# Altium project Daughter_Board_IFRX_L.PrjPcb (part 1 of 2)
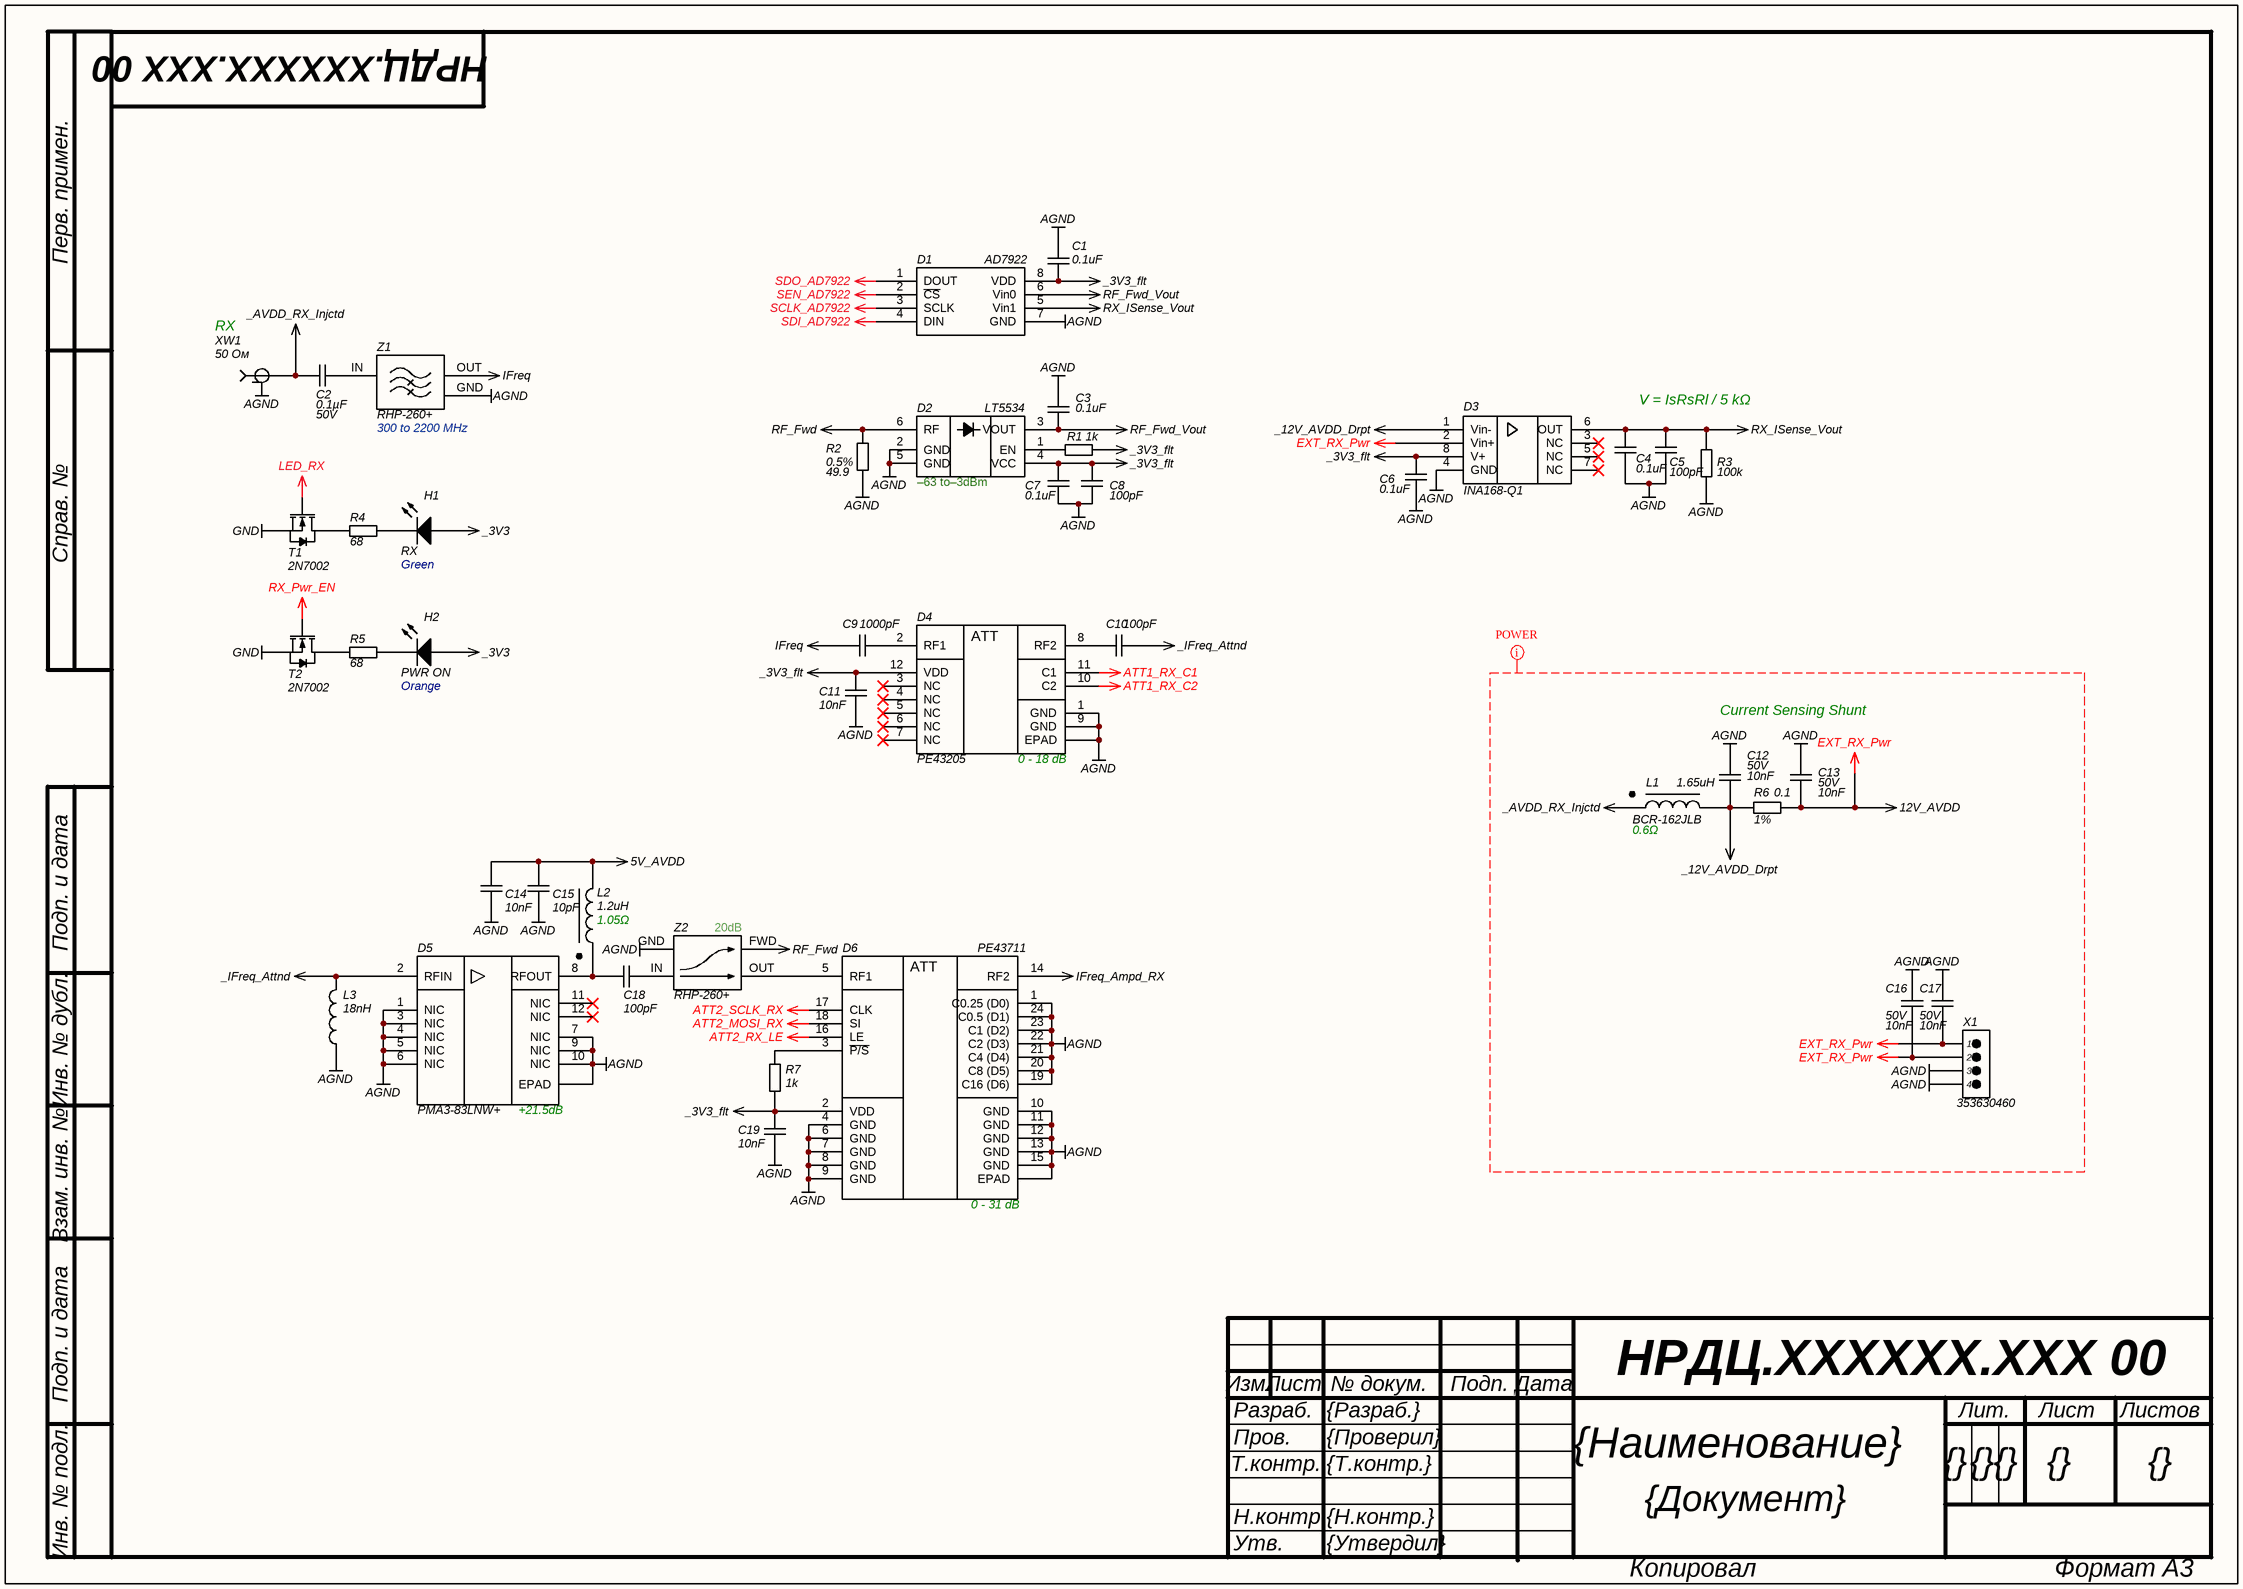
[diagram p0: RX.SchDoc]
7 sheets, 373 parts. Net scope: global (net labels, ports and power ports of the same name join across sheets).
Sheets:
  RX.SchDoc
  IF_RX.SchDoc
  ADC.SchDoc
  ADC_CLK.SchDoc
  CPLD.SchDoc
  Power.SchDoc
  DBoard_Conn.SchDoc

## Sheet RX.SchDoc: {Наименование}
size 420 x 297 mm; ApprovedBy: {Утвердил}; CheckedBy: {Проверил}; DrawnBy: {Разраб.}; DocumentNumber: НРДЦ.ХХХХХХ.ХХХ 00; SheetNumber: {}; SheetTotal: {}; Scale: {Мш.}; PageSetup: Record=PageOptions|CenterHorizontal=False|CenterVertical=False|PrintScale=0.95|XCorrection=0.00|YCorrection=0.00|PrintKind=1|BorderSize=5000000|LeftOffset=0|BottomOffset=0|Orientation=1|PaperLength=1000|PaperWidth=1000|Scale=100|PaperSource=15|PrintQuality=600|MediaType=1|DitherType=10|PaperKind=A4|PrintScaleMode=1; ProcessInspection: {Т.контр.}; Mass: {М.}; NormInspection: {Н.контр.}; Letter1Column: {}; Letter2Column: {}; Letter3Column: {}; DocumentType: {Документ}; Rule: PcbType=ProtelPcb

### Parts
C1  value 0.1uF  [C0402]  (hidden comment: CAP)
C2  value 0.1µF  Voltage: 50V  [C1206]  (hidden comment: CAP)
C3  value 0.1uF  [C0402]  (hidden comment: CAP)
C4  value 0.1uF  [C0402]  (hidden comment: CAP)
C5  value 100pF  [C0402]  (hidden comment: CAP)
C6  value 0.1uF  [C0402]  (hidden comment: CAP)
C7  value 0.1uF  [C0402]  (hidden comment: CAP)
C8  value 100pF  [C0402]  (hidden comment: CAP)
C9  value 1000pF  [C0402]  (hidden comment: CAP)
C10  value 100pF  [C0402]  (hidden comment: CAP)
C11  value 10nF  [C0402]  (hidden comment: CAP)
C12  value 10nF  Voltage: 50V  [C0402]  (hidden comment: CAP)
C13  value 10nF  Voltage: 50V  [C0402]  (hidden comment: CAP)
C14  value 10nF  [C0402]  (hidden comment: CAP)
C15  value 10pF  [C0402]  (hidden comment: CAP)
C16  value 10nF  Voltage: 50V  [C0402]  (hidden comment: CAP)
C17  value 10nF  Voltage: 50V  [C0402]  (hidden comment: CAP)
C18  value 100pF  [C0402]  (hidden comment: CAP)
C19  value 10nF  [C0402]  (hidden comment: CAP)
D1  AD7922  [MSOP-8]
D2  LT5534  RF Input Power Range: –63 to–3dBm  [SC70]
D3  INA168-Q1  [TSSOP (8)]
D4  PE43205  [QFN-12]
D5  PMA3-83LNW+  [DQ1225]
D6  PE43711  [QFN-24]
H1  RX  Color: Green  [LED]
H2  PWR ON  Color: Orange  [LED]
L1  BCR-162JLB  value 1.65uH  DCR: 0.6Ω  [BCR-162]
L2  value 1.2uH  DCR: 1.05Ω  [BCR-122]  (hidden comment: Inductor_BCR)
L3  value 18nH  [L0603_HP]  (hidden comment: Inductor RF)
R1  value 1k  [R0402]  (hidden comment: RES)
R2  value 49.9  Tolerance: 0.5%  [R0402]  (hidden comment: RES)
R3  value 100k  [R0402]  (hidden comment: RES)
R4  value 68  [R0402]  (hidden comment: RES)
R5  value 68  [R0402]  (hidden comment: RES)
R6  value 0.1  Tolerance: 1%  [R0805]  (hidden comment: RES)
R7  value 1k  [R0402]  (hidden comment: RES)
T1  2N7002  [SOT-23]
T2  2N7002  [SOT-23]
X1  353630460  [CON_353630460]
XW1  50 Ом  [MOLEX SD-73251-135 (Gold)]
Z1  RHP-260+  Frequency: 300 to 2200 MHz  [GP731]
Z2  RHP-260+  Coupling: 20dB  [AH202]

### Nets
5V_AVDD: C14.2 C15.2 L2.2
12V_AVDD: C13.1 C16.2 C17.2 D3.2(Vin+) R6.1 X1.1 X1.2  [also labelled EXT_RX_Pwr]
_3V3: H1.2(A) H2.2(A)
_3V3_flt: C1.1 C6.2 C7.2 C8.2 C11.2 C19.2 D1.8(VDD) D2.4(VCC) D3.8(V+) D4.12(VDD) D6.2(VDD) R1.1 R7.1
_12V_AVDD_Drpt: C12.1 D3.1(Vin-) L1.2 R6.2
_AVDD_RX_Injctd: C2.1 L1.1 XW1.S(RF)
_IFreq_Attnd: C10.2 D5.2(RFIN) L3.2
AGND: C1.2 C3.1 C4.1 C5.1 C6.1 C7.1 C8.1 C11.1 C12.2 C13.2 C14.1 C15.1 C16.1 C17.1 C19.1 D1.7(GND) D2.2(GND) D2.5(GND) D3.4(GND) D4.1(GND) D4.9(GND) D4.13(EPAD) D5.1(NIC) D5.3(NIC) D5.4(NIC) D5.5(NIC) D5.6(NIC) D5.7(NIC) D5.9(NIC) D5.10(NIC) D5.13(EPAD) D6.1(C0.25_(D0)) D6.4(GND) D6.6(GND) D6.7(GND) D6.8(GND) D6.9(GND) D6.10(GND) D6.11(GND) D6.12(GND) D6.13(GND) D6.15(GND) D6.19(C16_(D6)) D6.20(C8_(D5)) D6.21(C4_(D4)) D6.22(C2_(D3)) D6.23(C1_(D2)) D6.24(C0.5_(D1)) D6.25(EPAD) L3.1 R2.2 R3.1 X1.3 X1.4 XW1.G(GND) Z1.GND
ATT1_RX_C1: D4.11(C1)
ATT1_RX_C2: D4.10(C2)
ATT2_MOSI_RX: D6.18(SI)
ATT2_RX_LE: D6.16(LE)
ATT2_SCLK_RX: D6.17(CLK)
GND: T1.2(S) T2.2(S)
IFreq: C9.1 Z1.OUT
IFreq_Ampd_RX: D6.14(RF2)
LED_RX: T1.1(G)
RF_Fwd: D2.6(RF) R2.1 Z2.FWD
RF_Fwd_Vout: C3.2 D1.6(Vin0) D2.3(VOUT)
RX_ISense_Vout: C4.2 C5.2 D1.5(Vin1) D3.6(OUT) R3.2
RX_Pwr_EN: T2.1(G)
SCLK_AD7922: D1.3(SCLK)
SDI_AD7922: D1.4(DIN)
SDO_AD7922: D1.1(DOUT)
SEN_AD7922: D1.2(~{CS})
NetC2_2: C2.2 Z1.IN
NetC9_2: C9.2 D4.2(RF1)
NetC10_1: C10.1 D4.8(RF2)
NetC18_1: C18.1 D5.8(RFOUT) L2.1
NetC18_2: C18.2 Z2.IN
NetD2_1: D2.1(EN) R1.2
NetD6_3: D6.3(~{P/S}) R7.2
NetD6_5: D6.5(RF1) Z2.OUT
NetH1_1: H1.1(K) R4.2
NetH2_1: H2.1(K) R5.1
NetR4_1: R4.1 T1.3(D)
NetR5_2: R5.2 T2.3(D)

Not connected (* = marked no-connect by the designer): D3 3(NC)* 5(NC)* 7(NC)*; D4 3(NC)* 4(NC)* 5(NC)* 6(NC)* 7(NC)*; D5 11(NIC)* 12(NIC)*; Z2 GND

### Layout directives
net class POWER: 12V_AVDD, _12V_AVDD_Drpt, _AVDD_RX_Injctd, AGND, EXT_RX_Pwr

### Notes on the sheet
- (near XW1) RX
- V = IsRsRl / 5 kΩ
- Current Sensing Shunt
- Labels drawn without touching a wire or pin: AGND
- Перв. примен.
- Справ. №
- Подп. и дата
- Инв. № дубл.
- Взам. инв. №
- Изм.
- Лист
- № докум.
- Подп.
- Дата
- Т.контр.
- Пров.
- Разраб.
- Лит.
- Листов
- Инв. № подл.
- Н.контр.
- Утв.
- Копировал
- Формат А3
- (in symbol PE43205) ATT; 0 - 18 dB
- (in symbol PE43711) ATT; 0 - 31 dB
- (in symbol PMA3-83LNW+) +21.5dB

### Library data of the parts
C1 C3 C4 C6 C7 = CAP: SMD Capacitor; Manufacturer: Murata; Material: X7R; Tolerance: 10%; Voltage: 10V; Type: Ceramic Capacitor; P/N: GRM155R71A104KA01J
C2 = CAP: SMD Capacitor; Manufacturer: Murata; Material: NP0; Tolerance: 5%; Type: Ceramic Capacitor; P/N: GRM31C5C1H104JA01K
C5 C8 C10 C18 = CAP: SMD Capacitor; Manufacturer: Murata; Material: NP0; Tolerance: 1%; Voltage: 50V; Type: Ceramic Capacitor; P/N: GRM1555C1H101FA01D
C9 = CAP: SMD Capacitor; Manufacturer: Murata; Material: NP0; Tolerance: 5%; Voltage: 50V; Type: Ceramic Capacitor; P/N: GRM1555C1H102JA01D
C11 C14 C19 = CAP: SMD Capacitor; Manufacturer: Murata; Material: X7R; Tolerance: 10%; Voltage: 25V; Type: Ceramic Capacitor; P/N: GRM155R71E103KA01D
C12 C13 C16 C17 = CAP: SMD Capacitor; Manufacturer: Murata; Material: X7R; Tolerance: 5%; Type: Ceramic Capacitor; P/N: GRM155R71H103JA88D
C15 = CAP: SMD Capacitor; Manufacturer: Murata; Material: NP0; Tolerance: 1%; Voltage: 50V; Type: Ceramic Capacitor; P/N: GRM1555C1H100FA01D
D1 = AD79x2: 1 MSPS, 10-/12-Bit ADC; Manufacturer: Analog Device; Fast throughput rate: 1MHz; High speed serial interface: SPI®/QSPI™/MICROWIRE™/DSP compatible; Name: AD7922ARM; Type: 2-Channel, 2.35 V to 5.25 V,1 MSPS, 10-/12-Bit ADC; Voltage: 2.35 V to 5.25 V; Package: MSOP-8
D2 = LT5534: 50MHz to 3GHz monolithic RF power / detector; Manufacturer: Linear Technology; Voltage: Single 2.7V to 5.25V; Impedance: 2kΩ; Frequency Range: 50 to 3000 MHz; Name: LT5534; Package: 6-Lead SC70; Type: RF Power Detector; P/N: LT5534; Supplier 1: Digi-Key; Supplier Part Number 1: LT5534ESC6#TRMPBFCT-ND
D3 = INA168-Q1: Automotive-Grade, High-Side, Current-Output, Current-Shunt Monitor; Manufacturer: Texas Instruments; Name: INA168Q; Voltage: 2.7 V to 60 V; P/N: INA168QPWRQ1; Voltage Gain: Adjustable; Frequency Range: 800kHz; Package: TSSOP (8); Type: Current-Shunt Monitor; Supplier 1: Digi-Key; Supplier Part Number 1: 296-17201-1-ND
D4 = PE43205: 50Ω, HaRP™ technology-enhanced / fast switching 2-bit RF Digital Step Attenuator; Manufacturer: Peregrine Technical Solutions; Type: 2-bit, 18 dB; Name: PE43205; P/N: PE43205; Package: Green 12-lead 3x3 mm QFN; Supplier 1: Digi-Key; Supplier Part Number 1: 1046-1114-6-ND
D5 = PMA3-83LNW+: PHEMT based wideband, low noise MMIC amplifier; Manufacturer: Mini-Circuits; Type: LNA; Frequency Range: 0.4 to 8.0 GHz; Impedance: 50Ω; Name: PMA3-83LNW+; Package: DQ1225; P/N: PMA3-83LNW+; Supplier 1: Digi-Key; Supplier Part Number 1: 3157-PMA3-83LNW+CT-ND
D6 = PE43711: The PE43711 is a 50Ω, HaRP™ technology-enhanced, 7-bit RF digital step attenuator; Manufacturer: Peregrine Technical Solutions; P/N: PE43711A-Z; Type: 7-bit RF digital step attenuator (DSA); Name: PE43711; Package: 24-lead 4 × 4 × 0.85 mm QFN; Supplier 1: Digi-Key; Supplier Part Number 1: 1046-1138-1-ND
H1 = LED: CHIP LED LAMP; Manufacturer: Kingbright; Name: APHCM2012; P/N: APHCM2012CGCK-F01; Package: 2.0 x 1.25 mm SMD; Type: CHIP LED LAMP; Supplier 1: Digi-Key; Supplier Part Number 1: 754-1094-1-ND
H2 = LED: CHIP LED LAMP; Manufacturer: Kingbright; Name: APHCM2012; P/N: APHCM2012SECK-F01; Package: 2.0 x 1.25 mm SMD; Type: CHIP LED LAMP
L1 = Inductor_BCR: Broadband Conical Inductor; Manufacturer: Coilcraft; Current: 490mA; Frequency: 40GHz; Tolerance: ±5%; Name: BCR-162JL; Series: BCR-162; Temperature Range: -25…85°C; P/N: BCR-162JLB
L2 = Inductor_BCR: Broadband Conical Inductor; Manufacturer: Coilcraft; Current: 270mA; Frequency: 40GHz; Name: BCR-122JL; Tolerance: ±5%; P/N: BCR-12LB; Series: BCR-122; Temperature Range: -25…85°C
L3 = Inductor RF: Chip SMD Inductor; Manufacturer: Coilcraft; Current: 1200mA; Frequency: 3.30GHz; Name: 0603HP-18NXJE; Tolerance: 5%; Series: 0603HP; Temperature Range: -25…85°C; P/N: 0603HP-18NXJE
R1 R7 = RES: SMD Resistor; Name: Chip SMD Resistor; Power: 0.062 Wt; Tolerance: 5%; P/N: ERJ-2GEJ102X; Temperature Range: -55…155°C
R2 = RES: SMD Resistor; Manufacturer: Panasonic Electronic Components; Name: Chip SMD Resistor; Power: 0.063 Wt; P/N: ERJ-2RKD49R9X; Temperature Range: -55…155°C
R3 = RES: SMD Resistor; Manufacturer: Panasonic Electronic Components; Name: Chip SMD Resistor; Power: 1/5 Wt; Tolerance: 1%; P/N: ERJ-PA2F1003X; Temperature Range: -55…155°C
R4 R5 = RES: SMD Resistor; Name: Chip SMD Resistor; Power: 0.062 Wt; Tolerance: 5%; P/N: ERJ-2GEJ680X; Temperature Range: -55…155°C
R6 = RES: SMD Resistor; Manufacturer: Panasonic Electronic Components; Name: Chip SMD Resistor; Power: 1/2 Wt; P/N: ERJ-6DSFR10V; Temperature Range: -55…155°C
T1 T2 = 2N7002: N-Channel MOSFET 2N7002; Channel Resistance: 5Ohm; Current: 300mA; Power Dissipation: 0.83W; Voltage: 60V; Name: 2N7002; Type: SOT-23; Package: SOT-23
X1 = 353630460: 2.00mm Pitch Sherlock Wire-to-Board Header, Right-Angle, with Positive Lock, 4 Circuits; Manufacturer: Molex; Mate-with P/N: 355070400; Mate-with Series: 35507; P/N: 353630460; Type: 2.00mm Pitch Sherlock Wire-to-Board Header, Right-Angle; Series: 35363; Pitch: 2.00mm; Name: 353630460; Supplier 1: Digi-Key; Supplier Part Number 1: WM18933-ND
XW1 = RF Connector: 50 Ohms, SMA Jack, Vertica; Manufacturer: Molex; Impedance: 50Ω; P/N: 0732511352; Name: SMA Jack; Type: 50 Ohms, SMA Jack, Vertical, PCB SMT, Gold (Au) Body; Supplier 1: Digi-Key; Supplier Part Number 1: WM9458-ND
Z1 = RHP-260+: High Pass Filter; Manufacturer: Mini-Circuits; Impedance: 50Ω; Name: RHP-260+; P/N: RHP-260+; Type: High Pass Filter; Package: GP731
Z2 = SYD-20-33+: Directional Coupler; Manufacturer: Mini-Circuits; Impedance: 50Ω; Frequency: 30 to 3000 MHz; Name: SYD-20-33+; P/N: SYD-20-33+; Type: Directional Coupler; Package: AH202

## Sheet IF_RX.SchDoc: {Наименование}
size 420 x 297 mm; DocumentNumber: НРДЦ.ХХХХХХ.ХХХ ХХ; SheetNumber: {}; SheetTotal: {}; PageSetup: Record=PageOptions|CenterHorizontal=False|CenterVertical=False|PrintScale=0.95|XCorrection=0.00|YCorrection=0.00|PrintKind=1|BorderSize=5000000|LeftOffset=0|BottomOffset=0|Orientation=1|PaperLength=1000|PaperWidth=1000|Scale=100|PaperSource=15|PrintQuality=600|MediaType=1|DitherType=10|PaperKind=A4|PrintScaleMode=1; Rule: PcbType=ProtelPcb
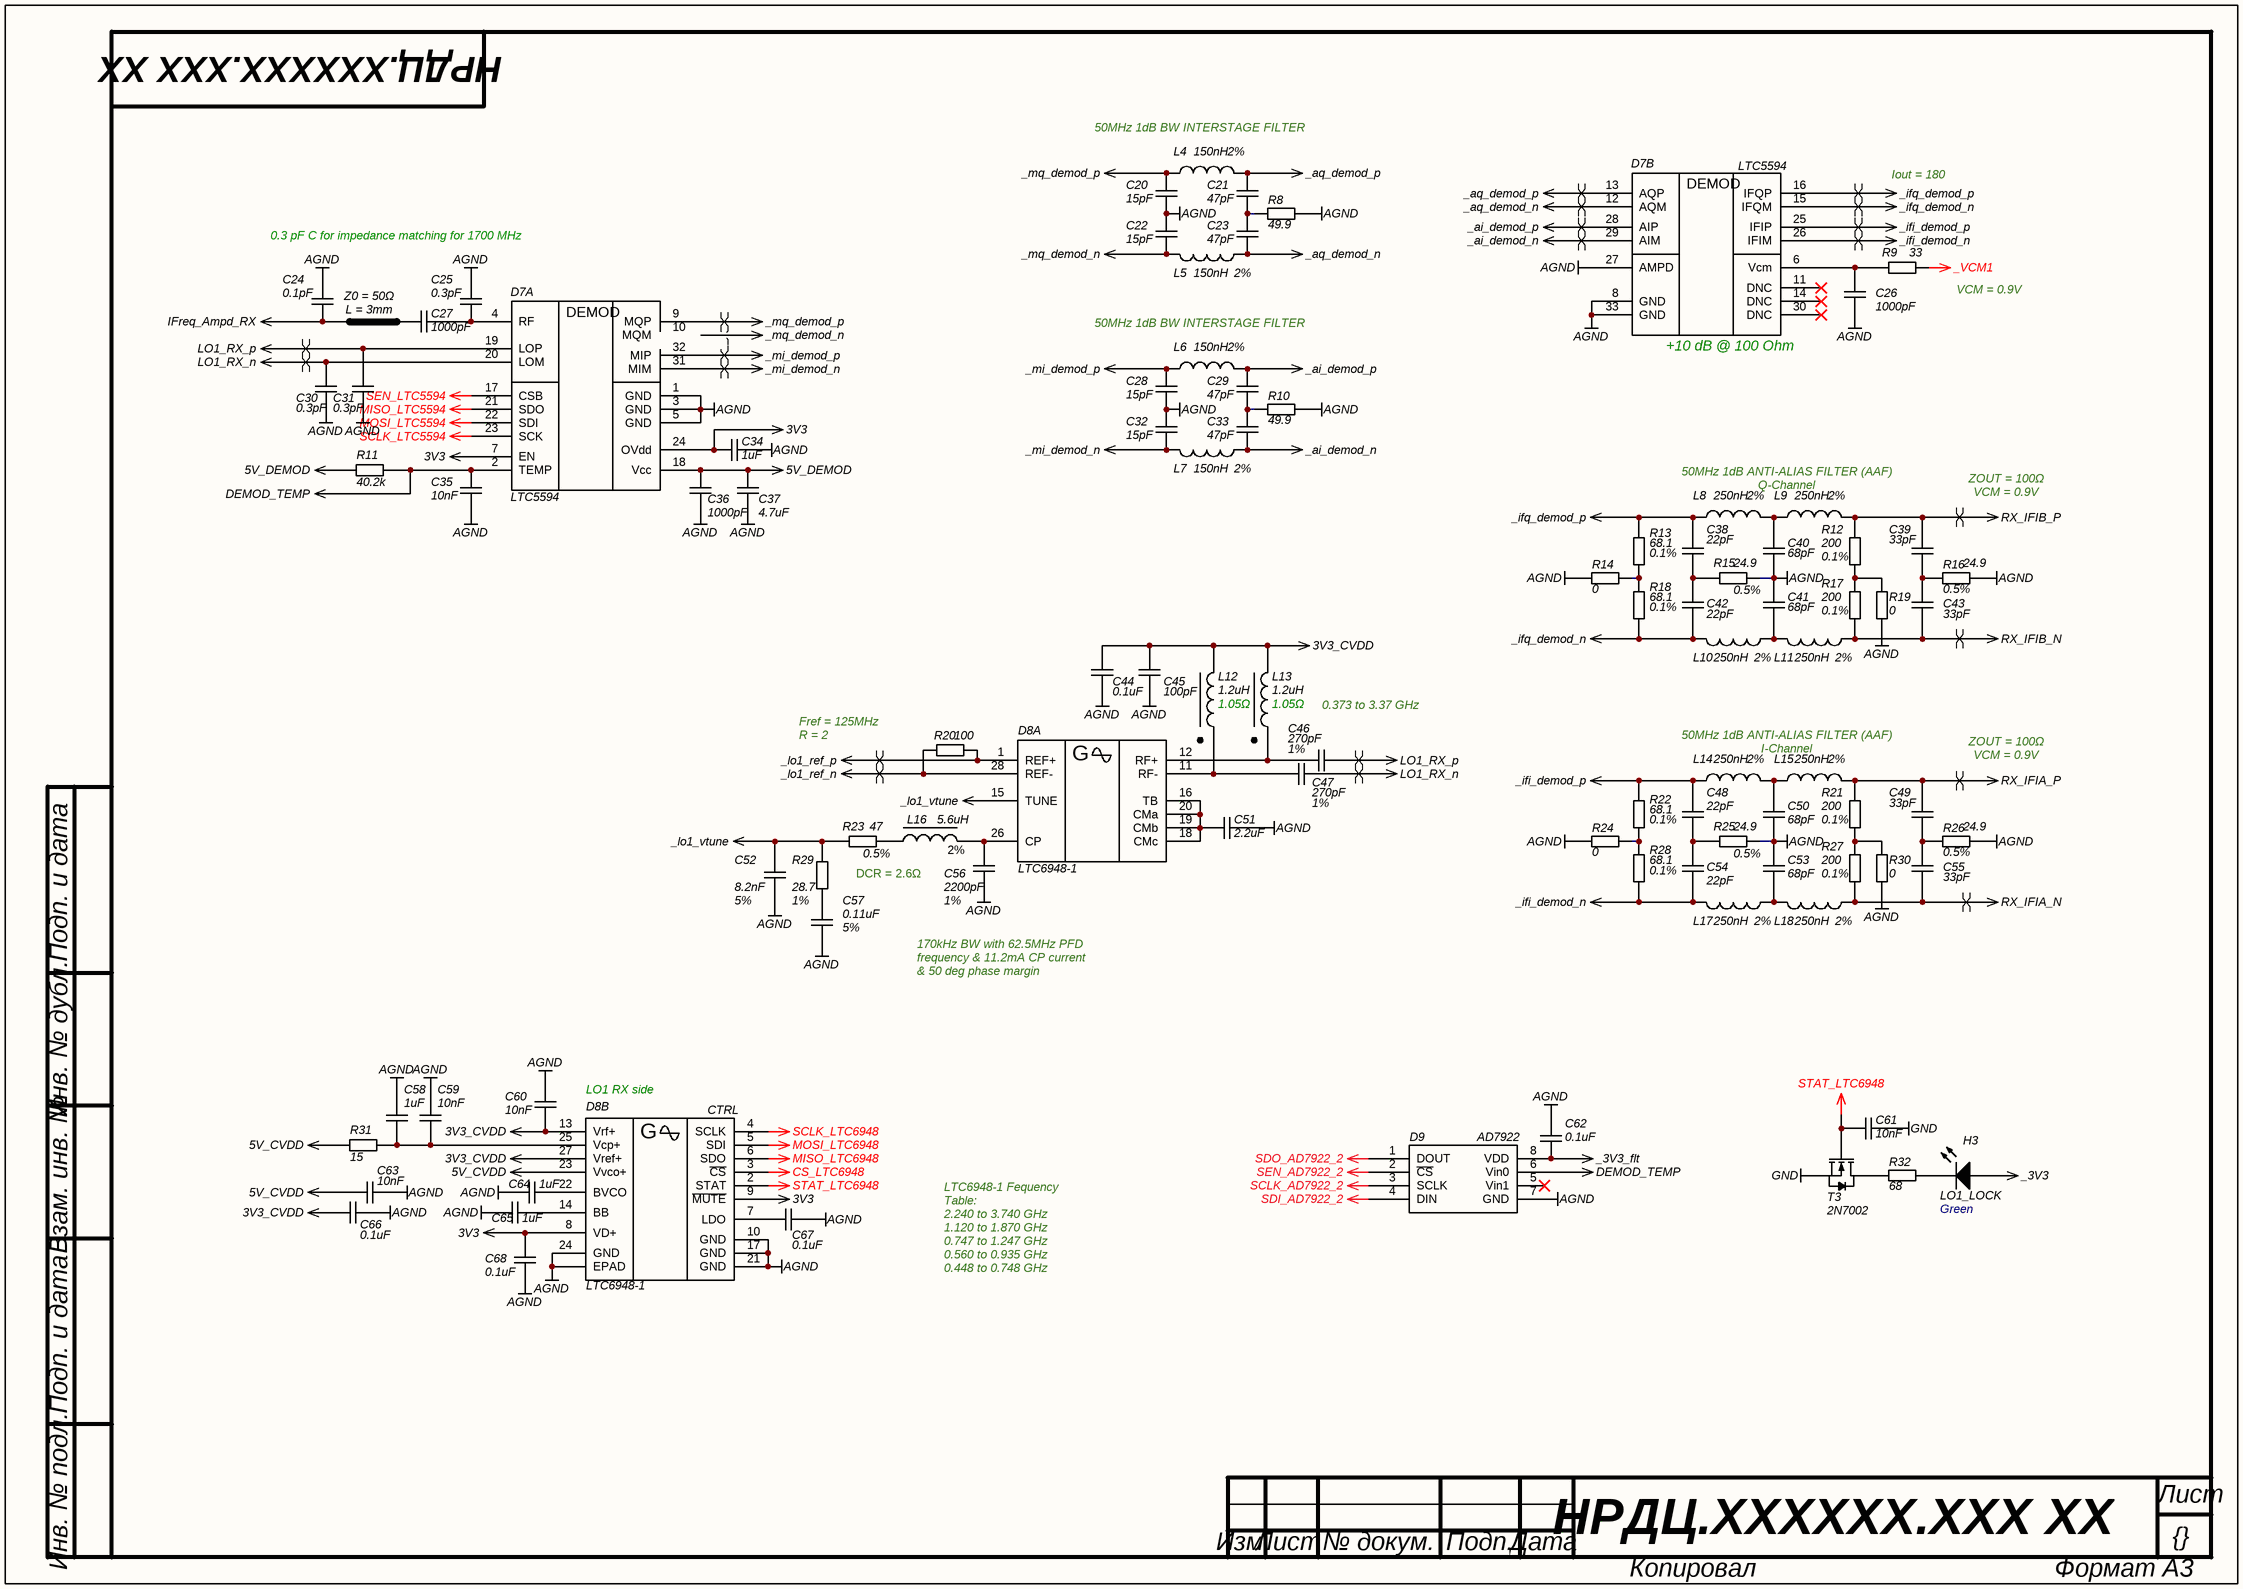
[diagram p1: IF_RX.SchDoc]

### Parts
C20  value 15pF  [C0402]  (hidden comment: CAP)
C21  value 47pF  [C0402]  (hidden comment: CAP)
C22  value 15pF  [C0402]  (hidden comment: CAP)
C23  value 47pF  [C0402]  (hidden comment: CAP)
C24  value 0.1pF  [C0402]  (hidden comment: CAP)
C25  value 0.3pF  [C0402]  (hidden comment: CAP)
C26  value 1000pF  [C0402]  (hidden comment: CAP)
C27  value 1000pF  [C0402]  (hidden comment: CAP)
C28  value 15pF  [C0402]  (hidden comment: CAP)
C29  value 47pF  [C0402]  (hidden comment: CAP)
C30  value 0.3pF  [C0402]  (hidden comment: CAP)
C31  value 0.3pF  [C0402]  (hidden comment: CAP)
C32  value 15pF  [C0402]  (hidden comment: CAP)
C33  value 47pF  [C0402]  (hidden comment: CAP)
C34  value 1uF  [C0805]  (hidden comment: CAP)
C35  value 10nF  [C0402]  (hidden comment: CAP)
C36  value 1000pF  [C0402]  (hidden comment: CAP)
C37  value 4.7uF  [C0805]  (hidden comment: CAP)
C38  value 22pF  [C0402]  (hidden comment: CAP)
C39  value 33pF  [C0402]  (hidden comment: CAP)
C40  value 68pF  [C0402]  (hidden comment: CAP)
C41  value 68pF  [C0402]  (hidden comment: CAP)
C42  value 22pF  [C0402]  (hidden comment: CAP)
C43  value 33pF  [C0402]  (hidden comment: CAP)
C44  value 0.1uF  [C0402]  (hidden comment: CAP)
C45  value 100pF  [C0402]  (hidden comment: CAP)
C46  value 270pF  Tolerance: 1%  [C0402]  (hidden comment: CAP)
C47  value 270pF  Tolerance: 1%  [C0402]  (hidden comment: CAP)
C48  value 22pF  [C0402]  (hidden comment: CAP)
C49  value 33pF  [C0402]  (hidden comment: CAP)
C50  value 68pF  [C0402]  (hidden comment: CAP)
C51  value 2.2uF  [C0603]  (hidden comment: CAP)
C52  value 8.2nF  Tolerance: 5%  [C0603]  (hidden comment: CAP)
C53  value 68pF  [C0402]  (hidden comment: CAP)
C54  value 22pF  [C0402]  (hidden comment: CAP)
C55  value 33pF  [C0402]  (hidden comment: CAP)
C56  value 2200pF  Tolerance: 1%  [C0603]  (hidden comment: CAP)
C57  value 0.11uF  Tolerance: 5%  [C0805]  (hidden comment: CAP)
C58  value 1uF  [C0805]  (hidden comment: CAP)
C59  value 10nF  [C0402]  (hidden comment: CAP)
C60  value 10nF  [C0402]  (hidden comment: CAP)
C61  value 10nF  [C0402]  (hidden comment: CAP)
C62  value 0.1uF  [C0402]  (hidden comment: CAP)
C63  value 10nF  [C0402]  (hidden comment: CAP)
C64  value 1uF  [C0805]  (hidden comment: CAP)
C65  value 1uF  [C0805]  (hidden comment: CAP)
C66  value 0.1uF  [C0402]  (hidden comment: CAP)
C67  value 0.1uF  [C0402]  (hidden comment: CAP)
C68  value 0.1uF  [C0402]  (hidden comment: CAP)
D7  LTC5594  [QFN-32]  (parts A,B of 2)
D8  LTC6948-1  [QFN-28]  (parts A,B of 2)
D9  AD7922  [MSOP-8]
H3  LO1_LOCK  Color: Green  [LED]
L4  value 150nH  Tolerance: 2%  [L0603_HP]  (hidden comment: Inductor RF)
L5  value 150nH  Tolerance: 2%  [L0603_HP]  (hidden comment: Inductor RF)
L6  value 150nH  Tolerance: 2%  [L0603_HP]  (hidden comment: Inductor RF)
L7  value 150nH  Tolerance: 2%  [L0603_HP]  (hidden comment: Inductor RF)
L8  value 250nH  Tolerance: 2%  [L0603_HP]  (hidden comment: Inductor RF)
L9  value 250nH  Tolerance: 2%  [L0603_HP]  (hidden comment: Inductor RF)
L10  value 250nH  Tolerance: 2%  [L0603_HP]  (hidden comment: Inductor RF)
L11  value 250nH  Tolerance: 2%  [L0603_HP]  (hidden comment: Inductor RF)
L12  value 1.2uH  DCR: 1.05Ω  [BCR-122]  (hidden comment: Inductor_BCR)
L13  value 1.2uH  DCR: 1.05Ω  [BCR-122]  (hidden comment: Inductor_BCR)
L14  value 250nH  Tolerance: 2%  [L0603_HP]  (hidden comment: Inductor RF)
L15  value 250nH  Tolerance: 2%  [L0603_HP]  (hidden comment: Inductor RF)
L16  value 5.6uH  Tolerance: 2%  [L0603_LS]  (hidden comment: Inductor)
L17  value 250nH  Tolerance: 2%  [L0603_HP]  (hidden comment: Inductor RF)
L18  value 250nH  Tolerance: 2%  [L0603_HP]  (hidden comment: Inductor RF)
R8  value 49.9  [R0402]  (hidden comment: RES)
R9  value 33  [R0603]  (hidden comment: RES)
R10  value 49.9  [R0402]  (hidden comment: RES)
R11  value 40.2k  [R0402]  (hidden comment: RES)
R12  value 200  Tolerance: 0.1%  [R0402]  (hidden comment: RES)
R13  value 68.1  Tolerance: 0.1%  [R0402]  (hidden comment: RES)
R14  value 0  [R0603]  (hidden comment: RES)
R15  value 24.9  Tolerance: 0.5%  [R0402]  (hidden comment: RES)
R16  value 24.9  Tolerance: 0.5%  [R0402]  (hidden comment: RES)
R17  value 200  Tolerance: 0.1%  [R0402]  (hidden comment: RES)
R18  value 68.1  Tolerance: 0.1%  [R0402]  (hidden comment: RES)
R19  value 0  [R0603]  (hidden comment: RES)
R20  value 100  [R0402]  (hidden comment: RES)
R21  value 200  Tolerance: 0.1%  [R0402]  (hidden comment: RES)
R22  value 68.1  Tolerance: 0.1%  [R0402]  (hidden comment: RES)
R23  value 47  Tolerance: 0.5%  [R0402]  (hidden comment: RES)
R24  value 0  [R0603]  (hidden comment: RES)
R25  value 24.9  Tolerance: 0.5%  [R0402]  (hidden comment: RES)
R26  value 24.9  Tolerance: 0.5%  [R0402]  (hidden comment: RES)
R27  value 200  Tolerance: 0.1%  [R0402]  (hidden comment: RES)
R28  value 68.1  Tolerance: 0.1%  [R0402]  (hidden comment: RES)
R29  value 28.7  Tolerance: 1%  [R0402]  (hidden comment: RES)
R30  value 0  [R0603]  (hidden comment: RES)
R31  value 15  [R0603]  (hidden comment: RES)
R32  value 68  [R0402]  (hidden comment: RES)
T3  2N7002  [SOT-23]

### Nets
3V3: C34.1 C68.2 D7.7(EN) D7.24(OVdd) D8.8(VD+) D8.9(~{MUTE})
3V3_CVDD: C44.2 C45.2 C60.2 C66.2 D8.13(Vrf+) D8.27(Vref+) L12.2 L13.2
5V_CVDD: C63.1 D8.23(Vvco+) R31.2
5V_DEMOD: C36.1 C37.2 D7.18(Vcc) R11.1
_3V3: H3.2(A)
_3V3_flt: C62.1 D9.8(VDD)
_ai_demod_n: C33.2 D7.29(AIM) L7.2
_ai_demod_p: C29.1 D7.28(AIP) L6.2
_aq_demod_n: C23.2 D7.12(AQM) L5.2
_aq_demod_p: C21.1 D7.13(AQP) L4.2
_ifi_demod_n: C54.2 D7.26(IFIM) L17.1 R28.2
_ifi_demod_p: C48.1 D7.25(IFIP) L14.1 R22.1
_ifq_demod_n: C42.2 D7.15(IFQM) L10.1 R18.2
_ifq_demod_p: C38.1 D7.16(IFQP) L8.1 R13.1
_lo1_ref_n: D8.28(REF-) R20.1
_lo1_ref_p: D8.1(REF+) R20.2
_lo1_vtune: C52.2 D8.15(TUNE) R23.2 R29.1
_mi_demod_n: C32.2 D7.31(MIM) L7.1
_mi_demod_p: C28.1 D7.32(MIP) L6.1
_mq_demod_n: C22.2 D7.10(MQM) L5.1
_mq_demod_p: C20.1 D7.9(MQP) L4.1
_VCM1: R9.1
AGND: C20.2 C22.1 C24.2 C25.1 C26.2 C28.2 C30.2 C31.2 C32.1 C34.2 C35.2 C36.2 C37.1 C40.2 C41.1 C44.1 C45.1 C50.2 C51.1 C52.1 C53.1 C56.1 C57.1 C58.1 C59.1 C60.1 C62.2 C63.2 C64.1 C65.2 C66.1 C67.1 C68.1 D7.1(GND) D7.3(GND) D7.5(GND) D7.8(GND) D7.27(AMPD) D7.33(GND) D8.10(GND) D8.17(GND) D8.21(GND) D8.24(GND) D8.29(EPAD) D9.7(GND) R8.2 R10.2 R14.1 R15.2 R16.2 R19.2 R24.1 R25.2 R26.2 R30.2
CS_LTC6948: D8.3(~{CS})
DEMOD_TEMP: C35.1 D7.2(TEMP) D9.6(Vin0) R11.2
GND: C61.2 T3.2(S)
IFreq_Ampd_RX: C24.1 C27.2
LO1_RX_n: C30.1 C47.2 D7.20(LOM)
LO1_RX_p: C31.1 C46.2 D7.19(LOP)
MISO_LTC5594: D7.21(SDO)
MISO_LTC6948: D8.6(SDO)
MOSI_LTC5594: D7.22(SDI)
MOSI_LTC6948: D8.5(SDI)
RX_IFIA_N: C55.2 L18.2 R27.2
RX_IFIA_P: C49.1 L15.2 R21.1
RX_IFIB_N: C43.2 L11.2 R17.2
RX_IFIB_P: C39.1 L9.2 R12.1
SCLK_AD7922_2: D9.3(SCLK)
SCLK_LTC5594: D7.23(SCK)
SCLK_LTC6948: D8.4(SCLK)
SDI_AD7922_2: D9.4(DIN)
SDO_AD7922_2: D9.1(DOUT)
SEN_AD7922_2: D9.2(~{CS})
SEN_LTC5594: D7.17(CSB)
STAT_LTC6948: C61.1 D8.2(STAT) T3.1(G)
NetC21_2: C21.2 C23.1 R8.1
NetC25_2: C25.2 C27.1 D7.4(RF)
NetC26_1: C26.1 D7.6(Vcm) R9.2
NetC29_2: C29.2 C33.1 R10.1
NetC38_2: C38.2 C42.1 R15.1
NetC39_2: C39.2 C43.1 R16.1
NetC40_1: C40.1 L8.2 L9.1
NetC41_2: C41.2 L10.2 L11.1
NetC46_1: C46.1 D8.12(RF+) L13.1
NetC47_1: C47.1 D8.11(RF-) L12.1
NetC48_2: C48.2 C54.1 R25.1
NetC49_2: C49.2 C55.1 R26.1
NetC50_1: C50.1 L14.2 L15.1
NetC51_2: C51.2 D8.16(TB) D8.18(CMc) D8.19(CMb) D8.20(CMa)
NetC53_2: C53.2 L17.2 L18.1
NetC56_2: C56.2 D8.26(CP) L16.2
NetC57_2: C57.2 R29.2
NetC58_2: C58.2 C59.2 D8.25(Vcp+) R31.1
NetC64_2: C64.2 D8.22(BVCO)
NetC65_1: C65.1 D8.14(BB)
NetC67_2: C67.2 D8.7(LDO)
NetH3_1: H3.1(K) R32.2
NetL16_1: L16.1 R23.1
NetR12_2: R12.2 R17.1 R19.1
NetR13_2: R13.2 R14.2 R18.1
NetR21_2: R21.2 R27.1 R30.1
NetR22_2: R22.2 R24.2 R28.1
NetR32_1: R32.1 T3.3(D)

Not connected (* = marked no-connect by the designer): D7 11(DNC)* 14(DNC)* 30(DNC)*; D9 5(Vin1)*

### Layout directives
differential pair: _ai_demod_n, _ai_demod_p, _aq_demod_n, _aq_demod_p, _ifi_demod_n, _ifi_demod_p, _ifq_demod_n, _ifq_demod_p, _lo1_ref_n, _lo1_ref_p, _mi_demod_n, _mi_demod_p, _mq_demod_n, _mq_demod_p, LO1_RX_n, LO1_RX_p, RX_IFIA_N, RX_IFIA_P, RX_IFIB_N, RX_IFIB_P

### Notes on the sheet
- 50MHz 1dB BW INTERSTAGE FILTER Q-Channel
- Iout = 180 mA
- 0.3 pF C for impedance matching for 1700 MHz
- Z0 = 50Ω
  L = 3mm
- (near R9) VCM = 0.9V
- (near D7) GJM1555C1H470FB01D
- 50MHz 1dB BW INTERSTAGE FILTER I-Channel
- 50MHz 1dB ANTI-ALIAS FILTER (AAF) Q-Channel
- ZOUT = 100Ω
  VCM = 0.9V
- 0.373 to 3.37 GHz
- (near R20) Fref = 125MHz
  R = 2
- 50MHz 1dB ANTI-ALIAS FILTER (AAF) I-Channel
- DCR = 2.6Ω
- 170kHz BW with 62.5MHz PFD frequency & 11.2mA CP current & 50 deg phase margin
- LO1 RX side
- LTC6948-1 Fequency Table:
  2.240 to 3.740 GHz
  1.120 to 1.870 GHz
  0.747 to 1.247 GHz
  0.560 to 0.935 GHz
  0.448 to 0.748 GHz
  0.373 to 0.623 GHz
- Подп. и дата
- Инв. № дубл.
- Взам. инв. №
- Инв. № подл.
- Лист
- Изм.
- № докум.
- Подп.
- Дата
- Копировал
- Формат А3
- (in symbol LTC5594, part A) DEMOD
- (in symbol LTC5594, part B) DEMOD; +10 dB @ 100 Ohm
- (in symbol LTC6948, part A) G
- (in symbol LTC6948, part B) CTRL; G

### Library data of the parts
C20 C22 C28 C32 = CAP: SMD Capacitor; Manufacturer: Murata; Material: NP0; Tolerance: 1%; Voltage: 50V; Type: Ceramic Capacitor; P/N: GJM1555C1H150FB01D
C21 C23 C29 C33 = CAP: SMD Capacitor; Manufacturer: Murata; Material: NP0; Tolerance: 1%; Voltage: 50V; Type: Ceramic Capacitor; P/N: GJM1555C1H470FB01D
C24 = CAP: SMD Capacitor; Manufacturer: Murata; Material: NP0; Tolerance: ±0.05pF; Voltage: 50V; Type: Ceramic Capacitor; P/N: GRM1555C1HR10WA01D
C25 C30 C31 = CAP: SMD Capacitor; Manufacturer: Murata; Material: NP0; Tolerance: ±0.05pF; Voltage: 50V; Type: Ceramic Capacitor; P/N: GRM1555C1HR30WA01D
C26 C27 C36 = CAP: as C9 on sheet RX
C34 C58 C64 C65 = CAP: SMD Capacitor; Manufacturer: Murata; Material: X7R; Tolerance: 10%; Voltage: 10V; Type: Ceramic Capacitor; P/N: GRM21BR71A105KA01K
C35 C59-C61 C63 = CAP: as C11 on sheet RX
C37 = CAP: SMD Capacitor; Manufacturer: Murata; Material: X5R; Tolerance: 10%; Voltage: 50V; Type: Ceramic Capacitor; P/N: GRM21BR61H475KE51L
C38 C42 C48 C54 = CAP: SMD Capacitor; Manufacturer: Murata; Material: NP0; Tolerance: 1%; Voltage: 50V; Type: Ceramic Capacitor; P/N: GJM1555C1H220FB01D
C39 C43 C49 C55 = CAP: SMD Capacitor; Manufacturer: Murata; Material: NP0; Tolerance: 1%; Voltage: 50V; Type: Ceramic Capacitor; P/N: GJM1555C1H330FB01D
C40 C41 C50 C53 = CAP: SMD Capacitor; Manufacturer: Murata; Material: NP0; Tolerance: 1%; Voltage: 50V; Type: Ceramic Capacitor; P/N: GCM1555C1H680FA16D
C44 C62 C66-C68 = CAP: as C1 on sheet RX
C45 = CAP: as C5 on sheet RX
C46 C47 = CAP: SMD Capacitor; Manufacturer: Murata; Material: NP0; Voltage: 50V; Type: Ceramic Capacitor; P/N: GRM1555C1H271FA01D
C51 = CAP: SMD Capacitor; Manufacturer: Murata; Material: X7R; Tolerance: 10%; Voltage: 10V; Type: Ceramic Capacitor; P/N: GRM188R71A225KE15J
C52 = CAP: SMD Capacitor; Manufacturer: Murata; Material: NP0; Voltage: 50V; Type: Ceramic Capacitor; P/N: GRM1885C1H822JA01D
C56 = CAP: SMD Capacitor; Manufacturer: Murata; Material: NP0; Voltage: 50V; Type: Ceramic Capacitor; P/N: GCM1885C1H222FA16D
C57 = CAP: SMD Capacitor; Manufacturer: Murata; Material: NP0; Voltage: 50V; Type: Ceramic Capacitor; P/N: GRM2195C1H113JA01D
D7 = LTC5594: Quadrature Demodulator; Manufacturer: Analog Devices; Type: High Linearity  I/Q Demodulator; P/N: LTC5594IUH#PBF; Name: LTC5594; Package: 32-Lead 5mm × 5mm QFN; Temperature Range: –40°C to 125°C; Supplier 1: Digi-Key; Supplier Part Number 1: LTC5594IUH#TRPBF-ND
D8 = LTC6948: The LTC®LTC6948 is a high performance, low noise, 6.39GHz  phase-locked loop (PLL); Manufacturer: Linear Technology; Voltage: 3.15 V ~ 5.25 V; Type: Clock/Frequency Synthesizer (RF/IF), Integer N; P/N: LTC6948IUFD-1; Package: 28-QFN (4x5); Temperature Range: -40°C ~ 105°C; Supplier 1: Digi-Key; Supplier Part Number 1: 505-LTC6948IUFD-1#TRPBFCT-ND; Name: LTC6948-1
D9 = AD79x2: as D1 on sheet RX; Package: MSOP-8
H3 = LED: as H1 on sheet RX; Package: 2.0 x 1.25 mm SMD; Type: CHIP LED LAMP; Supplier 1: Digi-Key; Supplier Part Number 1: 754-1094-1-ND
L4-L7 = Inductor RF: Chip SMD Inductor; Manufacturer: Coilcraft; Current: 390mA; Frequency: 1.35GHz; Name: 0603HP-R15XGE; Series: 0603HP; Temperature Range: -25…85°C; P/N: 0603HP-R15XGE
L8-L11 L14 L15 L17 L18 = Inductor RF: Chip SMD Inductor; Manufacturer: Coilcraft; Current: 240mA; Frequency: 1.05GHz; Name: 0603HP-R25XGE; Series: 0603HP; Temperature Range: -25…85°C; P/N: 0603HP-R25XGE
L12 L13 = Inductor_BCR: as L2 on sheet RX; Series: BCR-122; Temperature Range: -25…85°C
L16 = Inductor: Chip SMD Inductor; Manufacturer: Coilcraft; Current: 240mA; Frequency: 32MHz; Name: 0603LS; P/N: 0603LS-562XGR; DCR: 2.6Ω; Series: 0603LS; Temperature Range: -25…85°C
R8 R10 = RES: SMD Resistor; Manufacturer: Panasonic Electronic Components; Name: Chip SMD Resistor; Power: 0.063 Wt; Tolerance: 0.5%; P/N: ERJ-2RKD49R9X; Temperature Range: -55…155°C
R9 = RES: SMD Resistor; Name: Chip SMD Resistor; Power: 0.1 Wt; Tolerance: 1%; P/N: ERJ-2RKF33R0X; Temperature Range: -55…155°C
R11 = RES: SMD Resistor; Manufacturer: Panasonic Electronic Components; Name: Chip SMD Resistor; Power: 0.063 Wt; Tolerance: 1%; P/N: ERJ-2RKF4022X; Temperature Range: -55…155°C
R12 R17 R21 R27 = RES: SMD Resistor; Manufacturer: Panasonic Electronic Components; Name: Chip SMD Resistor; Power: 0.063 Wt; P/N: ERA-2AEB201X; Temperature Range: -55…155°C
R13 R18 R22 R28 = RES: SMD Resistor; Manufacturer: Panasonic Electronic Components; Name: Chip SMD Resistor; Power: 0.063 Wt; P/N: ERA-2AEB68R1X; Temperature Range: -55…155°C
R14 R19 R24 R30 = RES: SMD Resistor; Name: Chip SMD Resistor; Power: 0.1 Wt; Tolerance: 1%; P/N: ERJ-2GE0R00X; Temperature Range: -55…155°C
R15 R16 R25 R26 = RES: SMD Resistor; Manufacturer: Panasonic Electronic Components; Name: Chip SMD Resistor; Power: 0.063 Wt; P/N: ERJ-2RKD24R9X; Temperature Range: -55…155°C
R20 = RES: SMD Resistor; Manufacturer: Panasonic Electronic Components; Name: Chip SMD Resistor; Power: 0.062 Wt; Tolerance: 5%; P/N: ERJ-2GEJ101X; Temperature Range: -55…155°C
R23 = RES: SMD Resistor; Manufacturer: Panasonic Electronic Components; Name: Chip SMD Resistor; Power: 0.2 Wt; P/N: ERA-2AED470X; Temperature Range: -55…155°C
R29 = RES: SMD Resistor; Manufacturer: Panasonic Electronic Components; Name: Chip SMD Resistor; Power: 0.2 Wt; P/N: ERJ-2RKF28R7X; Temperature Range: -55…155°C
R31 = RES: SMD Resistor; Name: Chip SMD Resistor; Power: 0.1 Wt; Tolerance: 1%; P/N: ERJ-3EKF15R0V; Temperature Range: -55…155°C
R32 = RES: as R4 on sheet RX; Temperature Range: -55…155°C
T3 = 2N7002: as T1 on sheet RX; Name: 2N7002; Type: SOT-23; Package: SOT-23

## Sheet ADC.SchDoc: {Наименование}
size 420 x 297 mm; DocumentNumber: НРДЦ.ХХХХХХ.ХХХ ХХ; SheetNumber: {}; SheetTotal: {}; PageSetup: Record=PageOptions|CenterHorizontal=False|CenterVertical=False|PrintScale=0.95|XCorrection=0.00|YCorrection=0.00|PrintKind=1|BorderSize=5000000|LeftOffset=0|BottomOffset=0|Orientation=1|PaperLength=1000|PaperWidth=1000|Scale=100|PaperSource=15|PrintQuality=600|MediaType=1|DitherType=10|PaperKind=A4|PrintScaleMode=1; Rule: PcbType=ProtelPcb
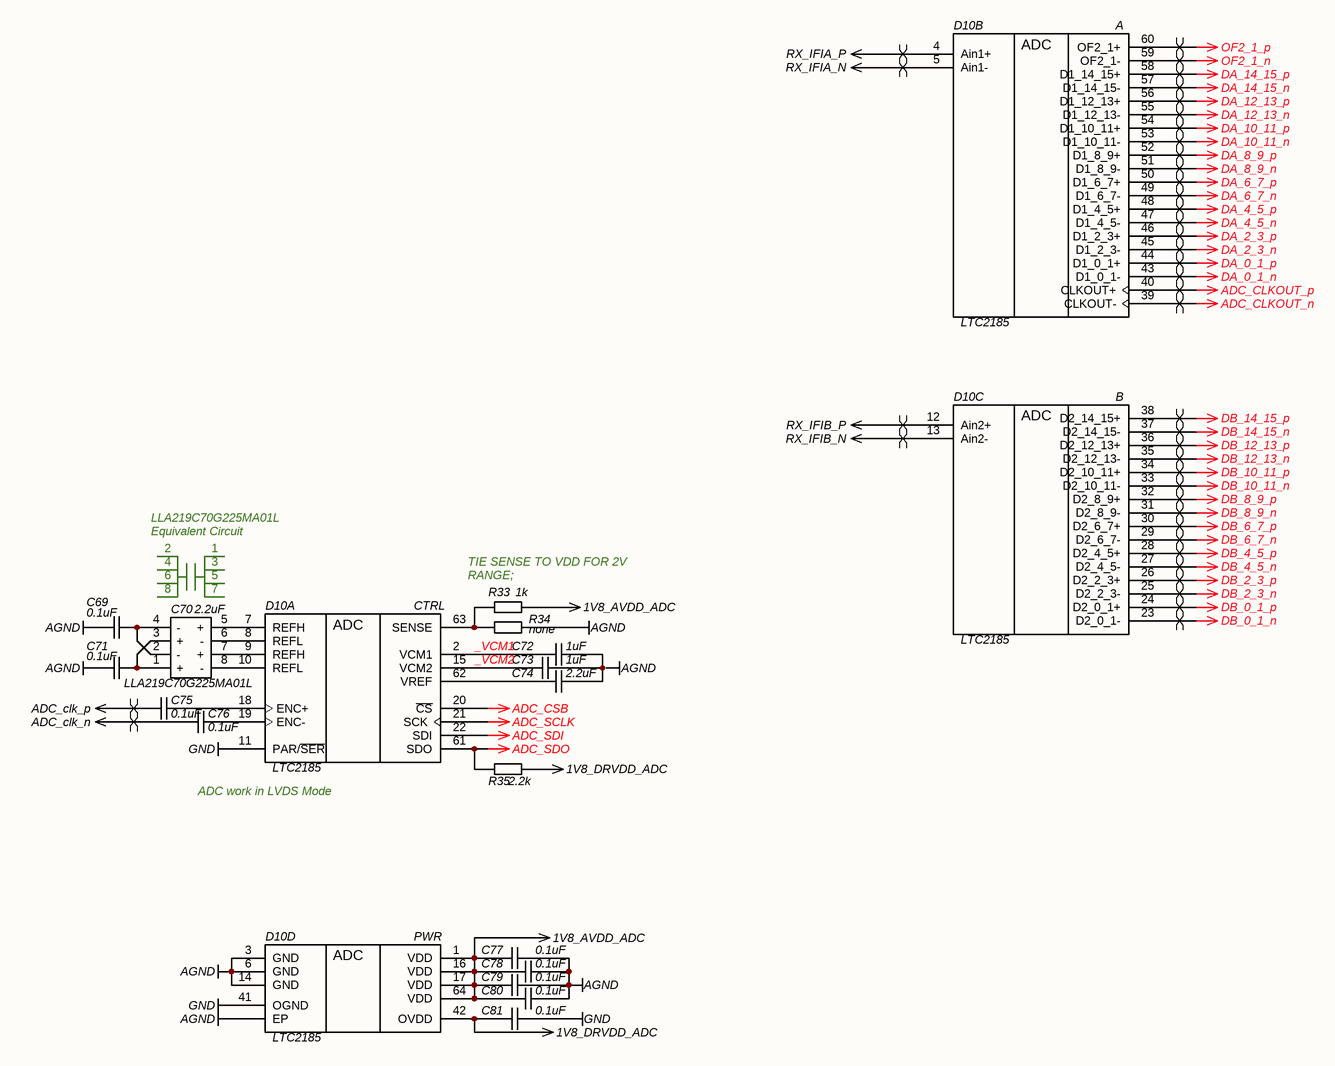
[diagram p2: ADC.SchDoc]

### Parts
C69  value 0.1uF  [C0402]  (hidden comment: CAP)
C70  LLA219C70G225MA01L  value 2.2uF  [Murata_LLA219-0_1_MFG]
C71  value 0.1uF  [C0402]  (hidden comment: CAP)
C72  value 1uF  [C0402]  (hidden comment: CAP)
C73  value 1uF  [C0402]  (hidden comment: CAP)
C74  value 2.2uF  [C0603]  (hidden comment: CAP)
C75  value 0.1uF  [C0402]  (hidden comment: CAP)
C76  value 0.1uF  [C0402]  (hidden comment: CAP)
C77  value 0.1uF  [C0402]  (hidden comment: CAP)
C78  value 0.1uF  [C0402]  (hidden comment: CAP)
C79  value 0.1uF  [C0402]  (hidden comment: CAP)
C80  value 0.1uF  [C0402]  (hidden comment: CAP)
C81  value 0.1uF  [C0402]  (hidden comment: CAP)
D10  LTC2185  [QFN-64]  (parts A,B,C,D of 4)
R33  value 1k  [R0402]  (hidden comment: RES)
R34  value none  [R0402]  (hidden comment: RES)
R35  value 2.2k  [R0402]  (hidden comment: RES)

### Nets
1V8_AVDD_ADC: C77.1 C78.1 C79.1 C80.1 D10.1(VDD) D10.16(VDD) D10.17(VDD) D10.64(VDD) R33.2
1V8_DRVDD_ADC: C81.2 D10.42(OVDD) R35.1
_VCM1: C72.2 D10.2(VCM1)
ADC_clk_n: C76.2
ADC_clk_p: C75.2
ADC_CLKOUT_n: D10.39(CLKOUT-)
ADC_CLKOUT_p: D10.40(CLKOUT+)
ADC_CSB: D10.20(~{CS})
ADC_SCLK: D10.21(SCK)
ADC_SDI: D10.22(SDI)
ADC_SDO: D10.61(SDO) R35.2
AGND: C69.1 C71.1 C77.2 C78.2 C79.2 C80.2 D10.0(EP) D10.3(GND) D10.6(GND) D10.14(GND) R34.2
DA_0_1_n: D10.43(D1_0_1-)
DA_0_1_p: D10.44(D1_0_1+)
DA_2_3_n: D10.45(D1_2_3-)
DA_2_3_p: D10.46(D1_2_3+)
DA_4_5_n: D10.47(D1_4_5-)
DA_4_5_p: D10.48(D1_4_5+)
DA_6_7_n: D10.49(D1_6_7-)
DA_6_7_p: D10.50(D1_6_7+)
DA_8_9_n: D10.51(D1_8_9-)
DA_8_9_p: D10.52(D1_8_9+)
DA_10_11_n: D10.53(D1_10_11-)
DA_10_11_p: D10.54(D1_10_11+)
DA_12_13_n: D10.55(D1_12_13-)
DA_12_13_p: D10.56(D1_12_13+)
DA_14_15_n: D10.57(D1_14_15-)
DA_14_15_p: D10.58(D1_14_15+)
DB_0_1_n: D10.23(D2_0_1-)
DB_0_1_p: D10.24(D2_0_1+)
DB_2_3_n: D10.25(D2_2_3-)
DB_2_3_p: D10.26(D2_2_3+)
DB_4_5_n: D10.27(D2_4_5-)
DB_4_5_p: D10.28(D2_4_5+)
DB_6_7_n: D10.29(D2_6_7-)
DB_6_7_p: D10.30(D2_6_7+)
DB_8_9_n: D10.31(D2_8_9-)
DB_8_9_p: D10.32(D2_8_9+)
DB_10_11_n: D10.33(D2_10_11-)
DB_10_11_p: D10.34(D2_10_11+)
DB_12_13_n: D10.35(D2_12_13-)
DB_12_13_p: D10.36(D2_12_13+)
DB_14_15_n: D10.37(D2_14_15-)
DB_14_15_p: D10.38(D2_14_15+)
GND: C81.1 D10.11(PAR/~{SER}) D10.41(OGND)
OF2_1_n: D10.59(OF2_1-)
OF2_1_p: D10.60(OF2_1+)
RX_IFIA_N: D10.5(Ain1-)
RX_IFIA_P: D10.4(Ain1+)
RX_IFIB_N: D10.13(Ain2-)
RX_IFIB_P: D10.12(Ain2+)
_VCM2: C73.2 D10.15(VCM2)
NetC69_2: C69.2 C70.2(-) C70.4(-)
NetC70_1: C70.1(+) C70.3(+) C71.2
NetC70_5: C70.5(+) D10.7(REFH)
NetC70_6: C70.6(-) D10.8(REFL)
NetC70_7: C70.7(+) D10.9(REFH)
NetC70_8: C70.8(-) D10.10(REFL)
NetC72_1: C72.1 C73.1 C74.1
NetC74_2: C74.2 D10.62(VREF)
NetC75_1: C75.1 D10.18(ENC+)
NetC76_1: C76.1 D10.19(ENC-)
NetD10_63: D10.63(SENSE) R33.1 R34.1

### Layout directives
differential pair: ADC_clk_n, ADC_clk_p, ADC_CLKOUT_n, ADC_CLKOUT_p, DA_0_1_n, DA_0_1_p, DA_2_3_n, DA_2_3_p, DA_4_5_n, DA_4_5_p, DA_6_7_n, DA_6_7_p, DA_8_9_n, DA_8_9_p, DA_10_11_n, DA_10_11_p, DA_12_13_n, DA_12_13_p, DA_14_15_n, DA_14_15_p, DB_0_1_n, DB_0_1_p, DB_2_3_n, DB_2_3_p, DB_4_5_n, DB_4_5_p, DB_6_7_n, DB_6_7_p, DB_8_9_n, DB_8_9_p, DB_10_11_n, DB_10_11_p, DB_12_13_n, DB_12_13_p, DB_14_15_n, DB_14_15_p, OF2_1_n, OF2_1_p, RX_IFIA_N, RX_IFIA_P, RX_IFIB_N, RX_IFIB_P

### Notes on the sheet
- LLA219C70G225MA01L
  Equivalent Circuit
- 2
- 4
- 6
- (near C70) 8
- 1
- 3
- 5
- (near C70) 7
- (near R33) TIE SENSE TO VDD FOR 2V RANGE;
  TIE SENSE TO GND FOR 1V RANGE;
- (near D10) ADC work in LVDS Mode Operation.
- Labels drawn without touching a wire or pin: AGND
- Подп. и дата
- Инв. № дубл.
- Взам. инв. №
- Инв. № подл.
- Лист
- Изм.
- № докум.
- Подп.
- Дата
- Копировал
- Формат А3
- (in symbol LTC2185, part A) CTRL; ADC
- (in symbol LTC2185, part B) A; ADC
- (in symbol LTC2185, part C) B; ADC
- (in symbol LTC2185, part D) PWR; ADC

### Library data of the parts
C69 C71 C75 C76 = CAP: as C1 on sheet RX
C70 = LLA219C70G225M: 0805 2.2 uF 4 V ±20 % Tolerance X7S Surface Mount Multilayer Ceramic Capacitor; Manufacturer: Murata; Tolerance: 20%; Voltage: 4V; Material: X7S; Type: Multilayer Ceramic Capacitor; Name: LLA219C70G225M; P/N: LLA219C70G225MA01L
C72 C73 = CAP: SMD Capacitor; Manufacturer: Murata; Material: X7R; Tolerance: 10%; Voltage: 6.3V; Type: Ceramic Capacitor; P/N: GRM155R70J105KA12D
C74 = CAP: SMD Capacitor; Manufacturer: Murata; Material: X7R; Tolerance: 10%; Voltage: 10V; Type: Ceramic Capacitor; P/N: GRM188R71A225KE15D
C77-C81 = CAP: SMD Capacitor; Manufacturer: Murata; Material: X7R; Tolerance: 10%; Voltage: 16V; Type: Ceramic Capacitor; P/N: GRM155R71C104KA88J
D10 = LTC2185: Dual 16-Bit, 125Msps  Low Power 3V ADC; Name: LTC2185CUP#PBF-ND; Power Dissipation: 370mW; Resolution: 16 Bits; Sampling Frequency: 125 MHz; Type: Dual 16-Bit, 105Msps  Low Power 3V ADC; Voltage: Single 1.8V Supply; Package: 64-Pin (9mm × 9mm) QFN; Temperature Range: 0°C to 70°C
R33 = RES: SMD Resistor; Manufacturer: Panasonic Electronic Components; Name: Chip SMD Resistor; Power: 0.062 Wt; Tolerance: 5%; P/N: ERJ-2GEJ102X; Temperature Range: -55…155°C
R34 = RES: SMD Resistor; Manufacturer: Panasonic Electronic Components; Name: Chip SMD Resistor; Power: 0.062 Wt; P/N: ERJ-2GE0R00X; Temperature Range: -55…155°C
R35 = RES: SMD Resistor; Name: Chip SMD Resistor; Power: 0.062 Wt; Tolerance: 5%; P/N: ERJ-2GEJ222X; Temperature Range: -55…155°C

## Sheet ADC_CLK.SchDoc: {Наименование}
size 420 x 297 mm; DocumentNumber: НРДЦ.ХХХХХХ.ХХХ ХХ; SheetNumber: {}; SheetTotal: {}; PageSetup: Record=PageOptions|CenterHorizontal=False|CenterVertical=False|PrintScale=0.95|XCorrection=0.00|YCorrection=0.00|PrintKind=1|BorderSize=5000000|LeftOffset=0|BottomOffset=0|Orientation=1|PaperLength=1000|PaperWidth=1000|Scale=100|PaperSource=15|PrintQuality=600|MediaType=1|DitherType=10|PaperKind=A4|PrintScaleMode=1; Rule: PcbType=ProtelPcb
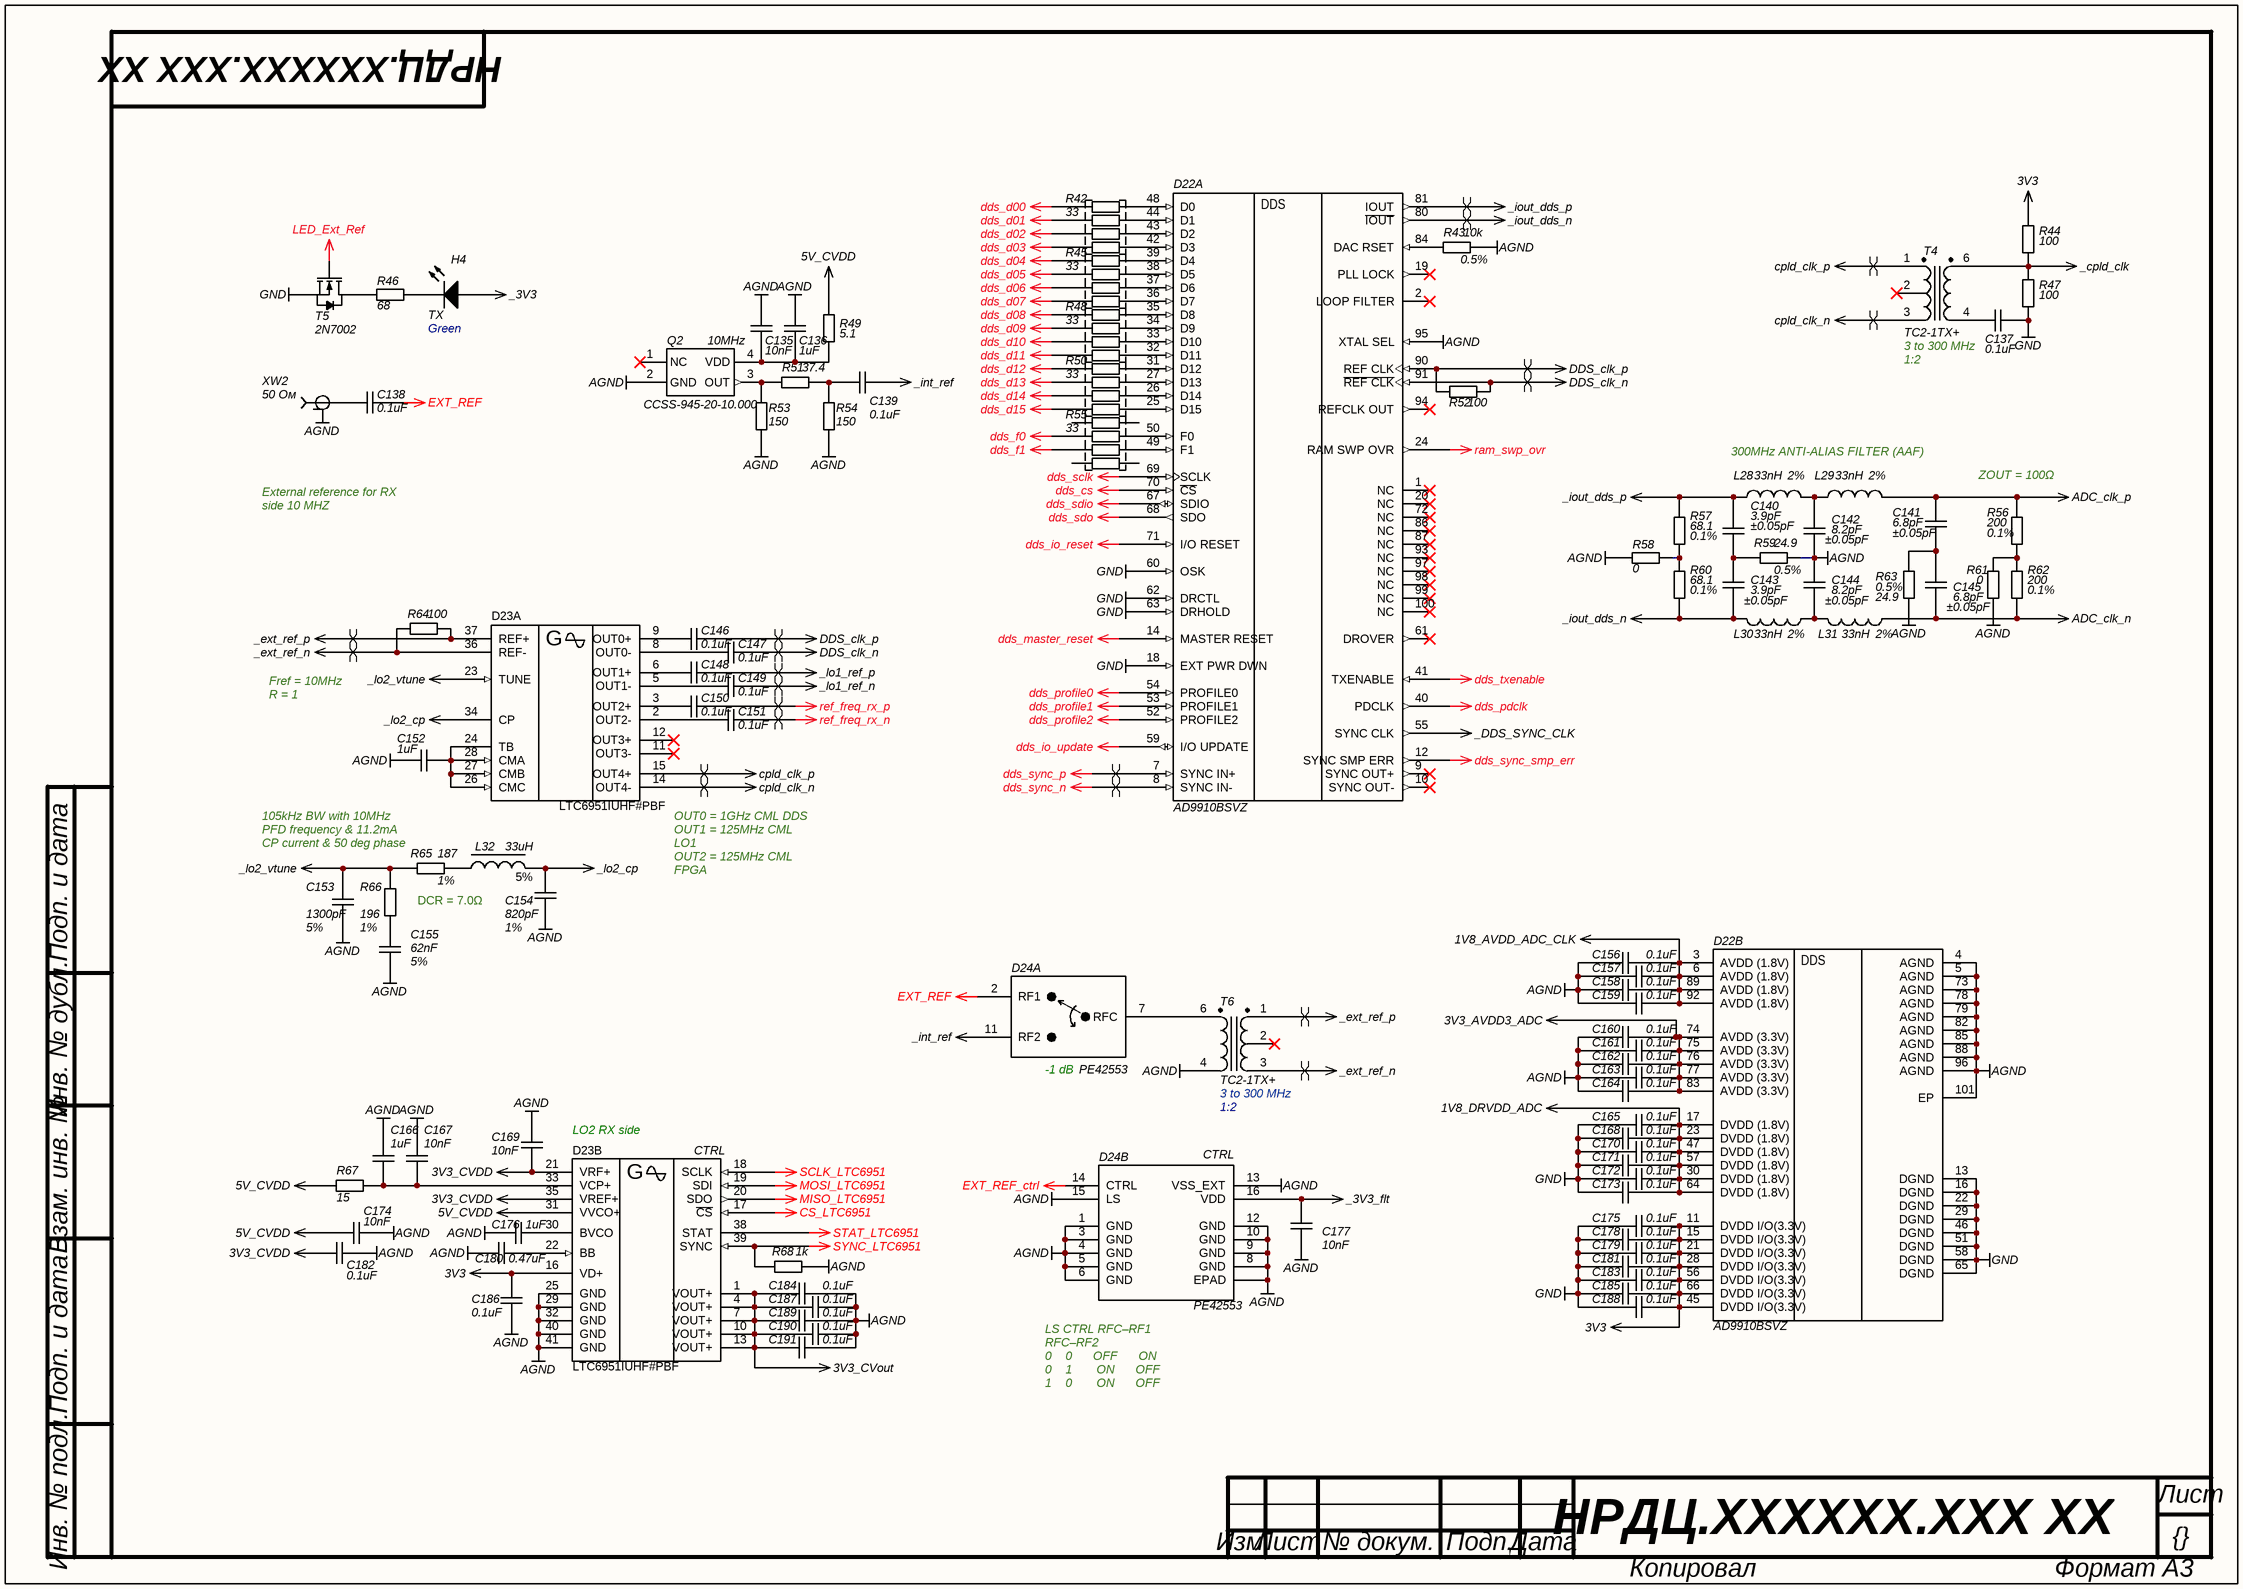
[diagram p3: ADC_CLK.SchDoc]

### Parts
C135  value 10nF  [C0402]  (hidden comment: CAP)
C136  value 1uF  [C0805]  (hidden comment: CAP)
C137  value 0.1uF  [C0402]  (hidden comment: CAP)
C138  value 0.1uF  [C0402]  (hidden comment: CAP)
C139  value 0.1uF  [C0402]  (hidden comment: CAP)
C140  value 3.9pF  Tolerance: ±0.05pF  [C0402]  (hidden comment: CAP)
C141  value 6.8pF  Tolerance: ±0.05pF  [C0402]  (hidden comment: CAP)
C142  value 8.2pF  Tolerance: ±0.05pF  [C0402]  (hidden comment: CAP)
C143  value 3.9pF  Tolerance: ±0.05pF  [C0402]  (hidden comment: CAP)
C144  value 8.2pF  Tolerance: ±0.05pF  [C0402]  (hidden comment: CAP)
C145  value 6.8pF  Tolerance: ±0.05pF  [C0402]  (hidden comment: CAP)
C146  value 0.1uF  [C0402]  (hidden comment: CAP)
C147  value 0.1uF  [C0402]  (hidden comment: CAP)
C148  value 0.1uF  [C0402]  (hidden comment: CAP)
C149  value 0.1uF  [C0402]  (hidden comment: CAP)
C150  value 0.1uF  [C0402]  (hidden comment: CAP)
C151  value 0.1uF  [C0402]  (hidden comment: CAP)
C152  value 1uF  [C0805]  (hidden comment: CAP)
C153  value 1300pF  Tolerance: 5%  [C0603]  (hidden comment: CAP)
C154  value 820pF  Tolerance: 1%  [C0603]  (hidden comment: CAP)
C155  value 62nF  Tolerance: 5%  [C1206]  (hidden comment: CAP)
C156  value 0.1uF  [C0402]  (hidden comment: CAP)
C157  value 0.1uF  [C0402]  (hidden comment: CAP)
C158  value 0.1uF  [C0402]  (hidden comment: CAP)
C159  value 0.1uF  [C0402]  (hidden comment: CAP)
C160  value 0.1uF  [C0402]  (hidden comment: CAP)
C161  value 0.1uF  [C0402]  (hidden comment: CAP)
C162  value 0.1uF  [C0402]  (hidden comment: CAP)
C163  value 0.1uF  [C0402]  (hidden comment: CAP)
C164  value 0.1uF  [C0402]  (hidden comment: CAP)
C165  value 0.1uF  [C0402]  (hidden comment: CAP)
C166  value 1uF  [C0805]  (hidden comment: CAP)
C167  value 10nF  [C0402]  (hidden comment: CAP)
C168  value 0.1uF  [C0402]  (hidden comment: CAP)
C169  value 10nF  [C0402]  (hidden comment: CAP)
C170  value 0.1uF  [C0402]  (hidden comment: CAP)
C171  value 0.1uF  [C0402]  (hidden comment: CAP)
C172  value 0.1uF  [C0402]  (hidden comment: CAP)
C173  value 0.1uF  [C0402]  (hidden comment: CAP)
C174  value 10nF  [C0402]  (hidden comment: CAP)
C175  value 0.1uF  [C0402]  (hidden comment: CAP)
C176  value 1uF  [C0805]  (hidden comment: CAP)
C177  value 10nF  [C0402]  (hidden comment: CAP)
C178  value 0.1uF  [C0402]  (hidden comment: CAP)
C179  value 0.1uF  [C0402]  (hidden comment: CAP)
C180  value 0.47uF  [C0603]  (hidden comment: CAP)
C181  value 0.1uF  [C0402]  (hidden comment: CAP)
C182  value 0.1uF  [C0402]  (hidden comment: CAP)
C183  value 0.1uF  [C0402]  (hidden comment: CAP)
C184  value 0.1uF  [C0402]  (hidden comment: CAP)
C185  value 0.1uF  [C0402]  (hidden comment: CAP)
C186  value 0.1uF  [C0402]  (hidden comment: CAP)
C187  value 0.1uF  [C0402]  (hidden comment: CAP)
C188  value 0.1uF  [C0402]  (hidden comment: CAP)
C189  value 0.1uF  [C0402]  (hidden comment: CAP)
C190  value 0.1uF  [C0402]  (hidden comment: CAP)
C191  value 0.1uF  [C0402]  (hidden comment: CAP)
D22  AD9910BSVZ  [Analog_Devices_SV-100-4_IPC_A]  (parts A,B of 2)
D23  LTC6951IUHF#PBF  [Analog_Devices_UHF-40-05-08-1951_IPC_A]  (parts A,B of 2)
D24  PE42553  [QFN-16]  (parts A,B of 2)
H4  TX  Color: Green  [LED]
L28  value 33nH  Tolerance: 2%  [L0603_HP]  (hidden comment: Inductor RF)
L29  value 33nH  Tolerance: 2%  [L0603_HP]  (hidden comment: Inductor RF)
L30  value 33nH  Tolerance: 2%  [L0603_HP]  (hidden comment: Inductor RF)
L31  value 33nH  Tolerance: 2%  [L0603_HP]  (hidden comment: Inductor RF)
L32  value 33uH  Tolerance: 5%  [L1008_LS]  (hidden comment: Inductor)
Q2  CCSS-945-20-10.000  Frequency: 10MHz  [CVCSO-914]
R42  value 33  [EXN8V]  (hidden comment: RES 4x0402)
R43  value 10k  Tolerance: 0.5%  [R0402]  (hidden comment: RES)
R44  value 100  [R0402]  (hidden comment: RES)
R45  value 33  [EXN8V]  (hidden comment: RES 4x0402)
R46  value 68  [R0402]  (hidden comment: RES)
R47  value 100  [R0402]  (hidden comment: RES)
R48  value 33  [EXN8V]  (hidden comment: RES 4x0402)
R49  value 5.1  [R0603]  (hidden comment: RES)
R50  value 33  [EXN8V]  (hidden comment: RES 4x0402)
R51  value 37.4  [R0402]  (hidden comment: RES)
R52  value 100  [R0402]  (hidden comment: RES)
R53  value 150  [R0402]  (hidden comment: RES)
R54  value 150  [R0402]  (hidden comment: RES)
R55  value 33  [EXN8V]  (hidden comment: RES 4x0402)
R56  value 200  Tolerance: 0.1%  [R0402]  (hidden comment: RES)
R57  value 68.1  Tolerance: 0.1%  [R0402]  (hidden comment: RES)
R58  value 0  [R0603]  (hidden comment: RES)
R59  value 24.9  Tolerance: 0.5%  [R0402]  (hidden comment: RES)
R60  value 68.1  Tolerance: 0.1%  [R0402]  (hidden comment: RES)
R61  value 0  [R0603]  (hidden comment: RES)
R62  value 200  Tolerance: 0.1%  [R0402]  (hidden comment: RES)
R63  value 24.9  Tolerance: 0.5%  [R0402]  (hidden comment: RES)
R64  value 100  [R0402]  (hidden comment: RES)
R65  value 187  Tolerance: 1%  [R0402]  (hidden comment: RES)
R66  value 196  Tolerance: 1%  [R0402]  (hidden comment: RES)
R67  value 15  [R0603]  (hidden comment: RES)
R68  value 1k  [R0402]  (hidden comment: RES)
T4  TC2-1TX+  Frequency: 3 to 300 MHz  Ratio: 1:2  [AT1521]
T5  2N7002  [SOT-23]
T6  TC2-1TX+  Frequency: 3 to 300 MHz  Ratio: 1:2  [AT1521]
XW2  50 Ом  [MOLEX SD-73251-135 (Gold)]

### Nets
1V8_AVDD_ADC_CLK: C156.2 C157.2 C158.2 C159.2 D22.3(AVDD_(1.8V)) D22.6(AVDD_(1.8V)) D22.89(AVDD_(1.8V)) D22.92(AVDD_(1.8V))
1V8_DRVDD_ADC: C165.2 C168.2 C170.2 C171.2 C172.2 C173.2 D22.17(DVDD_(1.8V)) D22.23(DVDD_(1.8V)) D22.30(DVDD_(1.8V)) D22.47(DVDD_(1.8V)) D22.57(DVDD_(1.8V)) D22.64(DVDD_(1.8V))
3V3: C175.2 C178.2 C179.2 C181.2 C183.2 C185.2 C186.2 C188.2 D22.11(DVDD_I/O(3.3V)) D22.15(DVDD_I/O(3.3V)) D22.21(DVDD_I/O(3.3V)) D22.28(DVDD_I/O(3.3V)) D22.45(DVDD_I/O(3.3V)) D22.56(DVDD_I/O(3.3V)) D22.66(DVDD_I/O(3.3V)) D23.16(VD+) R44.2
3V3_AVDD3_ADC: C160.2 C161.2 C162.2 C163.2 C164.2 D22.74(AVDD_(3.3V)) D22.75(AVDD_(3.3V)) D22.76(AVDD_(3.3V)) D22.77(AVDD_(3.3V)) D22.83(AVDD_(3.3V))
3V3_CVDD: C169.2 C182.2 D23.21(VRF+) D23.35(VREF+)
3V3_CVout: C184.1 C187.1 C189.1 C190.1 C191.1 D23.1(VOUT+) D23.4(VOUT+) D23.7(VOUT+) D23.10(VOUT+) D23.13(VOUT+)
5V_CVDD: C174.1 D23.31(VVCO+) R49.2 R67.2
_3V3: H4.2(A)
_3V3_flt: C177.1 D24.16(VDD)
_cpld_clk: R44.1 R47.2 T4.6
_DDS_SYNC_CLK: D22.55(SYNC_CLK)
_ext_ref_n: D23.36(REF-) R64.1 T6.3
_ext_ref_p: D23.37(REF+) R64.2 T6.1
_int_ref: C139.1 D24.11(RF2)
_iout_dds_n: C143.2 D22.80(~{IOUT}) L30.1 R60.2
_iout_dds_p: C140.1 D22.81(IOUT) L28.1 R57.1
_lo1_ref_n: C149.1
_lo1_ref_p: C148.1
_lo2_cp: C154.2 D23.34(CP) L32.2
_lo2_vtune: C153.2 D23.23(TUNE) R65.2 R66.1
ADC_clk_n: C145.2 L31.2 R62.2
ADC_clk_p: C141.1 L29.2 R56.1
AGND: C135.1 C136.1 C142.2 C144.1 C152.1 C153.1 C154.1 C155.1 C156.1 C157.1 C158.1 C159.1 C160.1 C161.1 C162.1 C163.1 C164.1 C166.1 C167.1 C169.1 C174.2 C176.1 C177.2 C180.2 C182.1 C184.2 C186.1 C187.2 C189.2 C190.2 C191.2 D22.4(AGND) D22.5(AGND) D22.73(AGND) D22.78(AGND) D22.79(AGND) D22.82(AGND) D22.85(AGND) D22.88(AGND) D22.95(XTAL_SEL) D22.96(AGND) D22.101(EP) D23.25(GND) D23.29(GND) D23.32(GND) D23.40(GND) D23.41(GND) D24.1(GND) D24.3(GND) D24.4(GND) D24.5(GND) D24.6(GND) D24.8(GND) D24.9(GND) D24.10(GND) D24.12(GND) D24.13(VSS_EXT) D24.15(LS) D24.17(EPAD) Q2.2(GND) R43.1 R53.2 R54.2 R58.1 R59.2 R61.2 R63.2 R68.1 T6.4 XW2.G(GND)
cpld_clk_n: D23.14(OUT4-) T4.3
cpld_clk_p: D23.15(OUT4+) T4.1
CS_LTC6951: D23.17(~{CS})
DDS_clk_n: C147.1 D22.91(~{REF_CLK}) R52.1
DDS_clk_p: C146.1 D22.90(REF_CLK) R52.2
dds_cs: D22.70(~{CS})
dds_d00: R42.5
dds_d01: R42.6
dds_d02: R42.7
dds_d03: R42.8
dds_d04: R45.5
dds_d05: R45.6
dds_d06: R45.7
dds_d07: R45.8
dds_d08: R48.5
dds_d09: R48.6
dds_d10: R48.7
dds_d11: R48.8
dds_d12: R50.5
dds_d13: R50.6
dds_d14: R50.7
dds_d15: R50.8
dds_f0: R55.6
dds_f1: R55.7
dds_io_reset: D22.71(I/O_RESET)
dds_io_update: D22.59(I/O_UPDATE)
dds_master_reset: D22.14(MASTER_RESET)
dds_pdclk: D22.40(PDCLK)
dds_profile0: D22.54(PROFILE0)
dds_profile1: D22.53(PROFILE1)
dds_profile2: D22.52(PROFILE2)
dds_sclk: D22.69(SCLK)
dds_sdio: D22.67(SDIO)
dds_sdo: D22.68(SDO)
dds_sync_n: D22.8(SYNC_IN-)
dds_sync_p: D22.7(SYNC_IN+)
dds_sync_smp_err: D22.12(SYNC_SMP_ERR)
dds_txenable: D22.41(TXENABLE)
EXT_REF: C138.1 D24.2(RF1)
EXT_REF_ctrl: D24.14(CTRL)
GND: C137.1 C165.1 C168.1 C170.1 C171.1 C172.1 C173.1 C175.1 C178.1 C179.1 C181.1 C183.1 C185.1 C188.1 D22.13(DGND) D22.16(DGND) D22.18(EXT_PWR_DWN) D22.22(DGND) D22.29(DGND) D22.46(DGND) D22.51(DGND) D22.58(DGND) D22.60(OSK) D22.62(DRCTL) D22.63(DRHOLD) D22.65(DGND) R47.1 T5.2(S)
LED_Ext_Ref: T5.1(G)
MISO_LTC6951: D23.20(SDO)
MOSI_LTC6951: D23.19(SDI)
ram_swp_ovr: D22.24(RAM_SWP_OVR)
ref_freq_rx_n: C151.1
ref_freq_rx_p: C150.1
SCLK_LTC6951: D23.18(SCLK)
STAT_LTC6951: D23.38(STAT)
SYNC_LTC6951: D23.39(SYNC) R68.2
NetC135_2: C135.2 C136.2 Q2.4(VDD) R49.1
NetC137_2: C137.2 T4.4
NetC138_2: C138.2 XW2.S(RF)
NetC139_2: C139.2 R51.1 R54.1
NetC140_2: C140.2 C143.1 R59.1
NetC141_2: C141.2 C145.1 R63.1
NetC142_1: C142.1 L28.2 L29.1
NetC144_2: C144.2 L30.2 L31.1
NetC146_2: C146.2 D23.9(OUT0+)
NetC147_2: C147.2 D23.8(OUT0-)
NetC148_2: C148.2 D23.6(OUT1+)
NetC149_2: C149.2 D23.5(OUT1-)
NetC150_2: C150.2 D23.3(OUT2+)
NetC151_2: C151.2 D23.2(OUT2-)
NetC152_2: C152.2 D23.24(TB) D23.26(CMC) D23.27(CMB) D23.28(CMA)
NetC155_2: C155.2 R66.2
NetC166_2: C166.2 C167.2 D23.33(VCP+) R67.1
NetC176_2: C176.2 D23.30(BVCO)
NetC180_1: C180.1 D23.22(BB)
NetD22_25: D22.25(D15) R50.1
NetD22_26: D22.26(D14) R50.2
NetD22_27: D22.27(D13) R50.3
NetD22_31: D22.31(D12) R50.4
NetD22_32: D22.32(D11) R48.1
NetD22_33: D22.33(D10) R48.2
NetD22_34: D22.34(D9) R48.3
NetD22_35: D22.35(D8) R48.4
NetD22_36: D22.36(D7) R45.1
NetD22_37: D22.37(D6) R45.2
NetD22_38: D22.38(D5) R45.3
NetD22_39: D22.39(D4) R45.4
NetD22_42: D22.42(D3) R42.1
NetD22_43: D22.43(D2) R42.2
NetD22_44: D22.44(D1) R42.3
NetD22_48: D22.48(D0) R42.4
NetD22_49: D22.49(F1) R55.2
NetD22_50: D22.50(F0) R55.3
NetD22_84: D22.84(DAC_RSET) R43.2
NetD24_7: D24.7(RFC) T6.6
NetH4_1: H4.1(K) R46.1
NetL32_1: L32.1 R65.1
NetQ2_3: Q2.3(OUT) R51.2 R53.1
NetR46_2: R46.2 T5.3(D)
NetR56_2: R56.2 R61.1 R62.1
NetR57_2: R57.2 R58.2 R60.1

Not connected (* = marked no-connect by the designer): D22 1(NC)* 2(LOOP_FILTER)* 9(SYNC_OUT+)* 10(SYNC_OUT-)* 19(PLL_LOCK)* 20(NC)* 61(DROVER)* 72(NC)* 86(NC)* 87(NC)* 93(NC)* 94(REFCLK_OUT)* 97(NC)* 98(NC)* 99(NC)* 100(NC)*; D23 11(OUT3-)* 12(OUT3+)*; Q2 1(NC)*; R55 1 4 5 8; T4 2*; T6 2*

### Layout directives
differential pair: _ext_ref_n, _ext_ref_p, _iout_dds_n, _iout_dds_p, _lo1_ref_n, _lo1_ref_p, cpld_clk_n, cpld_clk_p, DDS_clk_n, DDS_clk_p, dds_sync_n, dds_sync_p, ref_freq_rx_n, ref_freq_rx_p

### Notes on the sheet
- External reference for RX side 10 MHZ
- 300MHz ANTI-ALIAS FILTER (AAF)
- ZOUT = 100Ω
- Fref = 10MHz
  R = 1
- (near R65) 105kHz BW with 10MHz PFD frequency & 11.2mA CP current & 50 deg phase margin
- DCR = 7.0Ω
- (near D23) OUT0 = 1GHz CML DDS
  OUT1 = 125MHz CML LO1
  OUT2 = 125MHz CML FPGA
  OUT3 = NC CML
  OUT4 = 62.5MHz LVDS CPLD
- LO2 RX side
- (near D24) LS CTRL RFC–RF1 RFC–RF2
  0    0      OFF      ON
  0    1       ON      OFF
  1    0       ON      OFF
  1    1      OFF      ON
- Подп. и дата
- Инв. № дубл.
- Взам. инв. №
- Инв. № подл.
- Лист
- Изм.
- № докум.
- Подп.
- Дата
- Копировал
- Формат А3
- (in symbol AD9910, part A) DDS
- (in symbol AD9910, part B) DDS
- (in symbol LTC6951, part A) G
- (in symbol LTC6951, part B) CTRL; G
- (in symbol PE42553, part A) -1 dB

### Library data of the parts
C135 C167 C169 C174 C177 = CAP: as C11 on sheet RX
C136 C152 C166 C176 = CAP: as C34 on sheet IF_RX
C137-C139 C146-C151 C182 C186 = CAP: as C1 on sheet RX
C140 C143 = CAP: SMD Capacitor; Manufacturer: Murata; Material: NP0; Voltage: 50V; Type: Ceramic Capacitor; P/N: GJM1555C1H3R9WB01D
C141 C145 = CAP: SMD Capacitor; Manufacturer: Murata; Material: NP0; Voltage: 50V; Type: Ceramic Capacitor; P/N: GJM1555C1H6R8WB01D
C142 C144 = CAP: SMD Capacitor; Manufacturer: Murata; Material: NP0; Voltage: 50V; Type: Ceramic Capacitor; P/N: GJM1555C1H8R2WB01D
C153 = CAP: SMD Capacitor; Manufacturer: Murata; Material: NP0; Voltage: 50V; Type: Ceramic Capacitor; P/N: GRM1885C1H132JA01D
C154 = CAP: SMD Capacitor; Manufacturer: Murata; Material: NP0; Voltage: 100V; Type: Ceramic Capacitor; P/N: GCM1885C2A821FA16D
C155 = CAP: SMD Capacitor; Manufacturer: Murata; Material: NP0; Voltage: 50V; Type: Ceramic Capacitor; P/N: GRM31C5C1H623JA01K
C156-C165 C168 C170-C173 C175 C178 C179 C181 C183-C185 C187-C191 = CAP: as C77 on sheet ADC
C180 = CAP: SMD Capacitor; Manufacturer: Murata; Material: X7R; Tolerance: 10%; Voltage: 16V; Type: Ceramic Capacitor; P/N: GCM188R71C474KA55D
D22 = AD9910: 1 GSPS, 14-Bit, 3.3 V CMOS / Direct Digital Synthesizer; P/N: AD9910BSVZ; Name: AD9910
D23 = LTC6951: Ultralow Jitter / Multioutput Clock Synthesizer / with Integrated VCO; Name: LTC6951; P/N: LTC6951IUHF#PBF
D24 = PE42553: HaRPTM technology-enhanced absorptive SPDT; Manufacturer: Peregrine Technical Solutions; P/N: PE42553A-Z; Type: SPDT RF Switch; Name: PE42553; Package: 16-lead 3 × 3 mm QFN; Supplier 1: Digi-Key; Supplier Part Number 1: 1046-1137-1-ND
H4 = LED: as H1 on sheet RX; Package: 2.0 x 1.25 mm SMD; Type: CHIP LED LAMP; Supplier 1: Digi-Key; Supplier Part Number 1: 754-1094-1-ND
L28-L31 = Inductor RF: Chip SMD Inductor; Manufacturer: Coilcraft; Current: 680mA; Frequency: 2.7GHz; Name: 0603HP-33NXGE; Series: 0603HP; Temperature Range: -25…85°C; P/N: 0603HP-33NXGE
L32 = Inductor: Chip SMD Inductor; Manufacturer: Coilcraft; Current: 200mA; Frequency: 32MHz; Name: 1008LS; P/N: 1008LS-333XJE; DCR: 7.0Ω; Series: 1008LS; Temperature Range: -25…85°C
Q2 = CCSS-945: Ultra Low Noise / SineWave Clock Oscillator; Input Current: 15mA Typical; Name: CCSS-945-10; Output: Unsymmetry; Output Current: ±24mA Max; Voltage: 5.0V; Package: 9×14 mm SMD; Temperature Range: 0°C to +70°C; P/N: CCSS-945-20-10.000; Type: SineWave Clock Oscillator
R42 R45 R48 R50 R55 = RES 4x0402: Chip Resistor Array; Manufacturer: Panasonic; Name: EXBN8V; Number of Resistors: 4; Tolerance: 5%; P/N: ERJ-2GEJ330X; Type: 0402 Array Concave Terminal; Number of Terminals: 8; Series: EXB
R43 = RES: SMD Resistor; Manufacturer: Panasonic Electronic Components; Name: Chip SMD Resistor; Power: 0.063 Wt; P/N: ERA-2AED103X; Temperature Range: -55…155°C
R44 R47 R52 R64 = RES: as R20 on sheet IF_RX; Temperature Range: -55…155°C
R46 = RES: as R4 on sheet RX; Temperature Range: -55…155°C
R49 = RES: SMD Resistor; Name: Chip SMD Resistor; Power: 0.1 Wt; Tolerance: 5%; P/N: ERJ-2GEJ5R1X; Temperature Range: -55…155°C
R51 = RES: SMD Resistor; Manufacturer: Panasonic Electronic Components; Name: Chip SMD Resistor; Power: 0.062 Wt; Tolerance: 5%; P/N: ERJ-2RKF37R4X; Temperature Range: -55…155°C
R53 R54 = RES: SMD Resistor; Manufacturer: Panasonic Electronic Components; Name: Chip SMD Resistor; Power: 0.062 Wt; Tolerance: 1%; P/N: ERJ-2RKF1500X; Temperature Range: -55…155°C
R56 R62 = RES: as R12 on sheet IF_RX; Temperature Range: -55…155°C
R57 R60 = RES: as R13 on sheet IF_RX; Temperature Range: -55…155°C
R58 R61 = RES: as R14 on sheet IF_RX; Temperature Range: -55…155°C
R59 R63 = RES: as R15 on sheet IF_RX; Temperature Range: -55…155°C
R65 = RES: SMD Resistor; Manufacturer: Panasonic Electronic Components; Name: Chip SMD Resistor; Power: 0.2 Wt; P/N: ERJ-2RKF1870X; Temperature Range: -55…155°C
R66 = RES: SMD Resistor; Manufacturer: Panasonic Electronic Components; Name: Chip SMD Resistor; Power: 0.2 Wt; P/N: ERJ-2RKF1960X; Temperature Range: -55…155°C
R67 = RES: as R31 on sheet IF_RX; Temperature Range: -55…155°C
R68 = RES: as R33 on sheet ADC; Temperature Range: -55…155°C
T4 T6 = TC2-1TX+: RF Transformer; Manufacturer: Mini-Circuits; Name: TC2-1TX+; P/N: TC2-1TX+; Type: RF Transformer; Package: AT1521
T5 = 2N7002: as T1 on sheet RX; Name: 2N7002; Type: SOT-23; Package: SOT-23
XW2 = RF Connector: as XW1 on sheet RX; Name: SMA Jack; Type: 50 Ohms, SMA Jack, Vertical, PCB SMT, Gold (Au) Body; Supplier 1: Digi-Key; Supplier Part Number 1: WM9458-ND